# EAGLE design main (EAGLE 5.11)

## Sheet 1 of 7
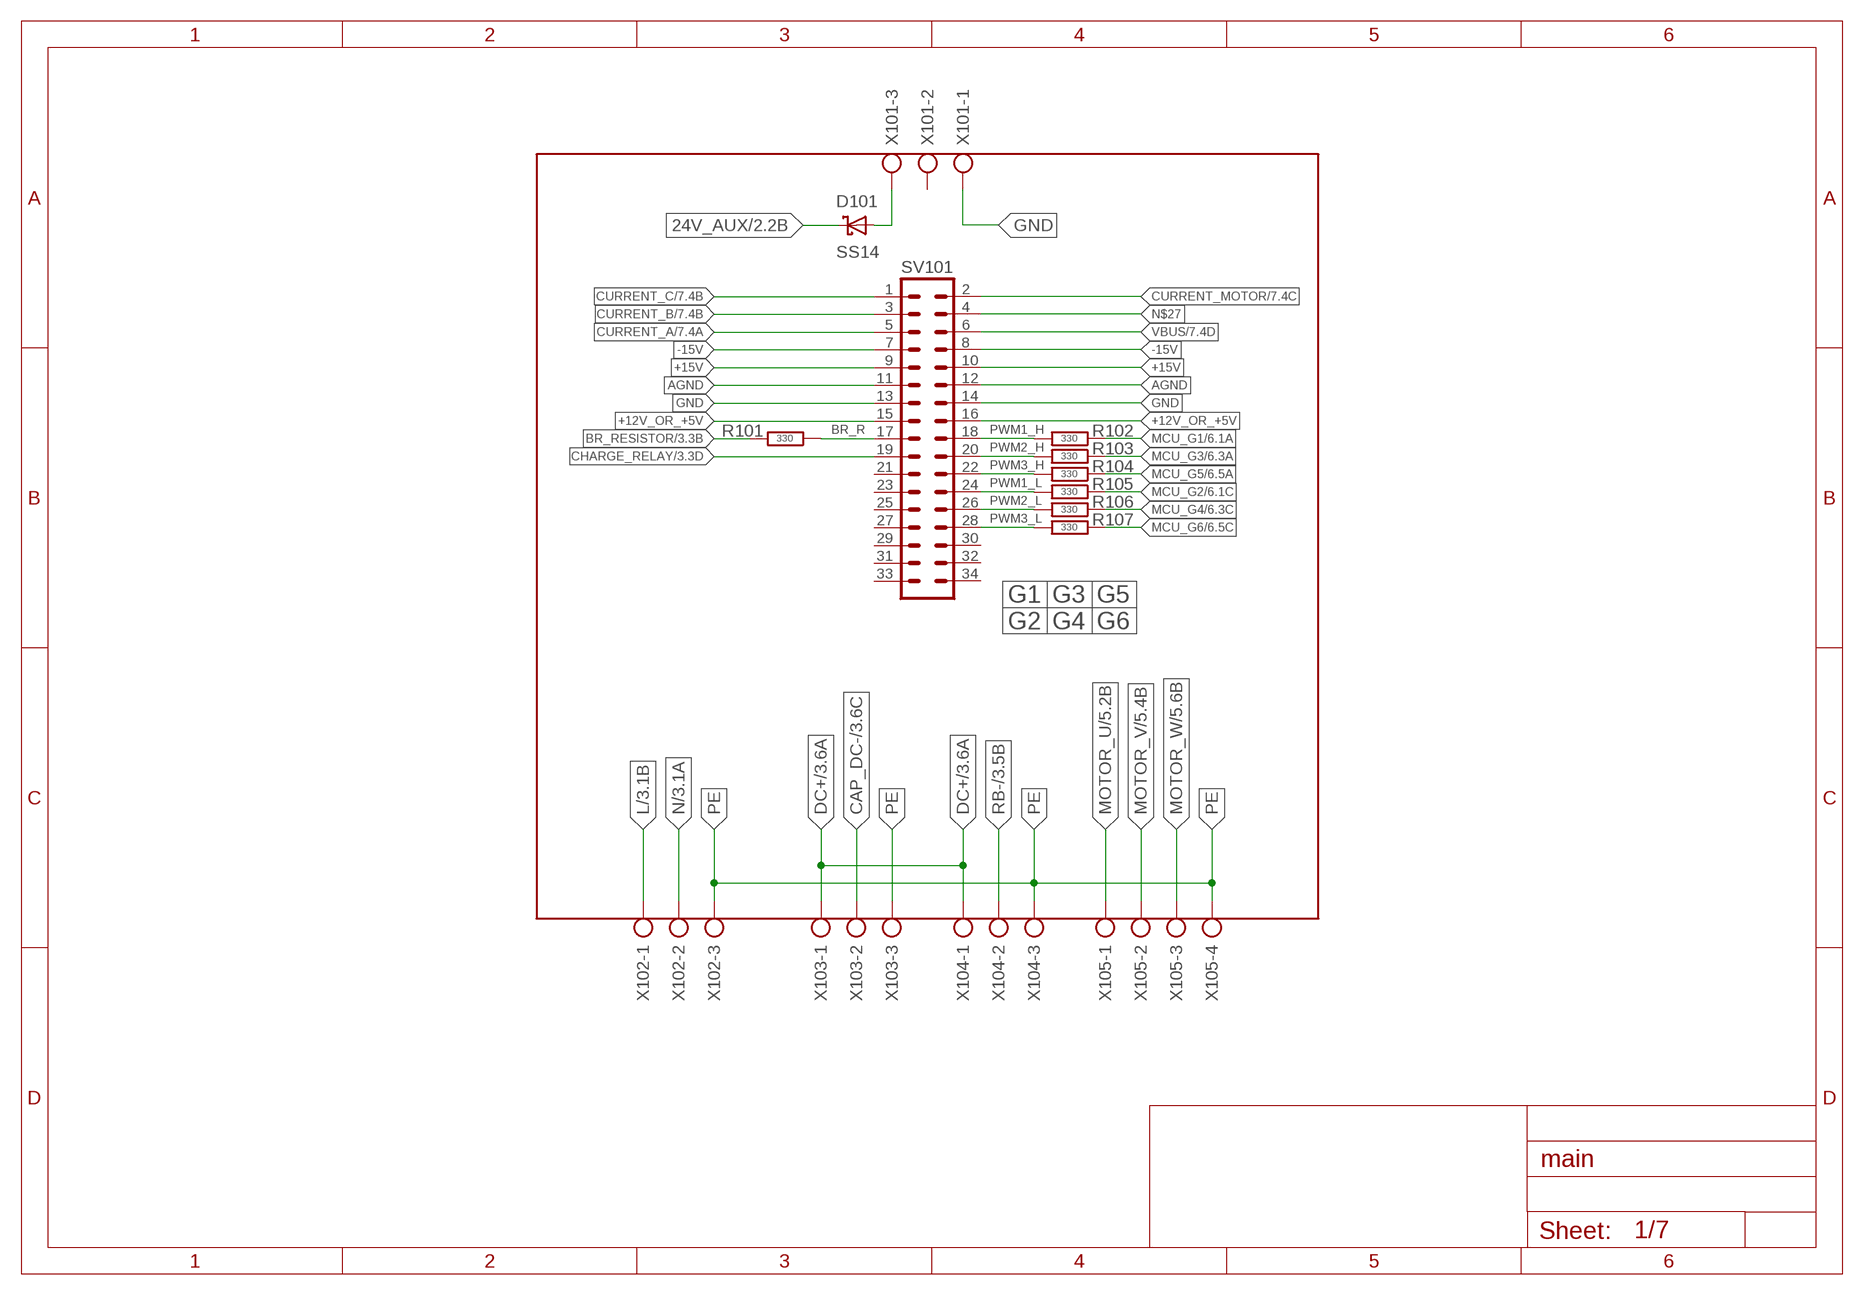
[diagram p0: schematic, sheet 1]

### Parts
D101  SS14  1N581SMD  [DO214AC]
R101  330  R-EU_R1206  [R1206]
R102  330  R-EU_R1206  [R1206]
R103  330  R-EU_R1206  [R1206]
R104  330  R-EU_R1206  [R1206]
R105  330  R-EU_R1206  [R1206]
R106  330  R-EU_R1206  [R1206]
R107  330  R-EU_R1206  [R1206]
SV101  ML34  [ML34]
X101  AK500/3-H  [AK500/3-H]
X102  AK500/3-H  [AK500/3-H]
X103  AK500/3-H  [AK500/3-H]
X104  AK500/3-H  [AK500/3-H]
X105  AK500/4-H  [AK500/4-H]

### Nets
24V_AUX: D101.C ; also sheet 2
+12V_OR_+5V: SV101.15 SV101.16 ; also sheet 2,3,4
+15V: SV101.9 SV101.10 ; also sheet 2,7
-15V: SV101.7 SV101.8 ; also sheet 2,7
AGND: SV101.11 SV101.12 ; also sheet 2,7
BR_R: R101.1 SV101.17
BR_RESISTOR: R101.2 ; also sheet 3
CAP_DC-: X103.2 ; also sheet 3,7
CHARGE_RELAY: SV101.19 ; also sheet 3
CURRENT_A: SV101.5 ; also sheet 7
CURRENT_B: SV101.3 ; also sheet 7
CURRENT_C: SV101.1 ; also sheet 7
CURRENT_MOTOR: SV101.2 ; also sheet 7
DC+: X103.1 X104.1 ; also sheet 3,5
GND: SV101.13 SV101.14 X101.1 ; also sheet 2,3,4,6
L: X102.1 ; also sheet 3
MCU_G1: R102.1 ; also sheet 6
MCU_G2: R105.1 ; also sheet 6
MCU_G3: R103.1 ; also sheet 6
MCU_G4: R106.1 ; also sheet 6
MCU_G5: R104.1 ; also sheet 6
MCU_G6: R107.1 ; also sheet 6
MOTOR_U: X105.1 ; also sheet 5,7
MOTOR_V: X105.2 ; also sheet 5,7
MOTOR_W: X105.3 ; also sheet 5,7
N: X102.2 ; also sheet 3
N$27: SV101.4
N$42: D101.A X101.3
PE: X102.3 X103.3 X104.3 X105.4
PWM1_H: R102.2 SV101.18
PWM1_L: R105.2 SV101.24
PWM2_H: R103.2 SV101.20
PWM2_L: R106.2 SV101.26
PWM3_H: R104.2 SV101.22
PWM3_L: R107.2 SV101.28
RB-: X104.2 ; also sheet 3
VBUS: SV101.6 ; also sheet 7
Unconnected: SV101.21 SV101.23 SV101.25 SV101.27 SV101.29 SV101.30 SV101.31 SV101.32 SV101.33 SV101.34 X101.2

### Notes on the sheet
- G1 | G3 | G5
- G2 | G4 | G6

## Sheet 2 of 7
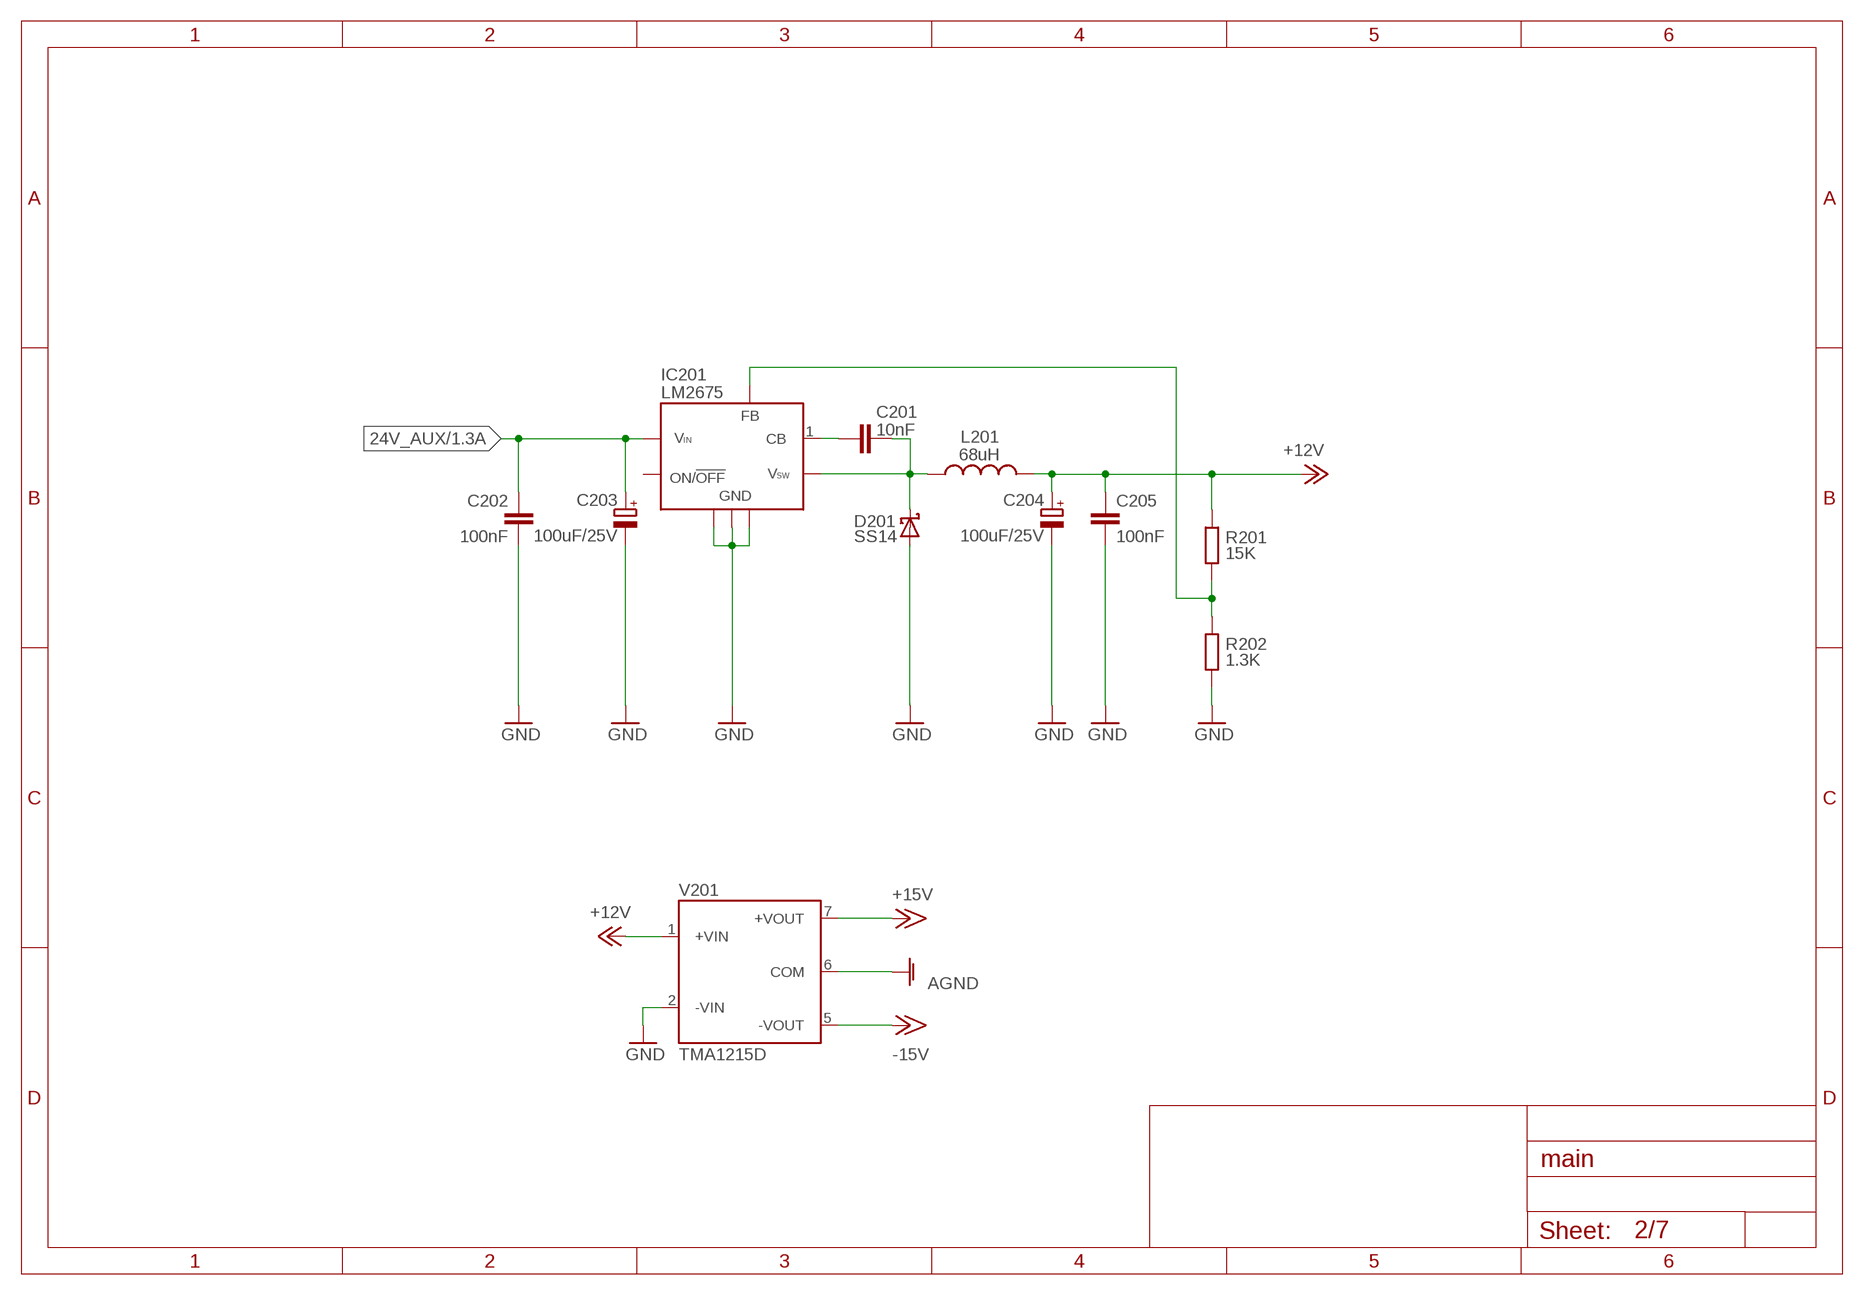
[diagram p1: schematic, sheet 2]

### Parts
C201  10nF  C-EUC0603  [C0603]
C202  100nF  C-EUC0603  [C0603]
C203  100uF/25V  CPOL-EUE2.5-5  [E2,5-5]
C204  100uF/25V  CPOL-EUE2,5-6E  [E2,5-6E]
C205  100nF  C-EUC0603  [C0603]
D201  SS14  1N581SMD  [DO214AC]
IC201  LM2675  [SO08]
L201  68uH  L-USSW45-V  [CW45-V]
R201  15K  R-EU_0204/2V  [0204V]
R202  1.3K  R-EU_R0603  [R0603]
V201  TMA1215D  TMA0515D  [TMA_DUAL]

### Nets
24V_AUX: C202.1 C203.+ IC201.7(VIN) ; also sheet 1
+12V_OR_+5V: C204.+ C205.1 L201.P$2 R201.2 V201.1(+VIN) ; supply symbol labelled +12V ; also sheet 1,3,4
+15V: V201.7(+VOUT) ; also sheet 1,7
-15V: V201.5(-VOUT) ; also sheet 1,7
AGND: V201.6(COM) ; also sheet 1,7
GND: C202.2 C203.- C204.- C205.2 D201.A IC201.2 IC201.3 IC201.6(GND) R202.1 V201.2(-VIN) ; also sheet 1,3,4,6
N$28: IC201.4(FB) R201.1 R202.2
N$72: C201.2 D201.C IC201.8(VSW) L201.P$1
N$80: C201.1 IC201.1(CB)
Unconnected: IC201.5(ON/!OFF)

## Sheet 3 of 7
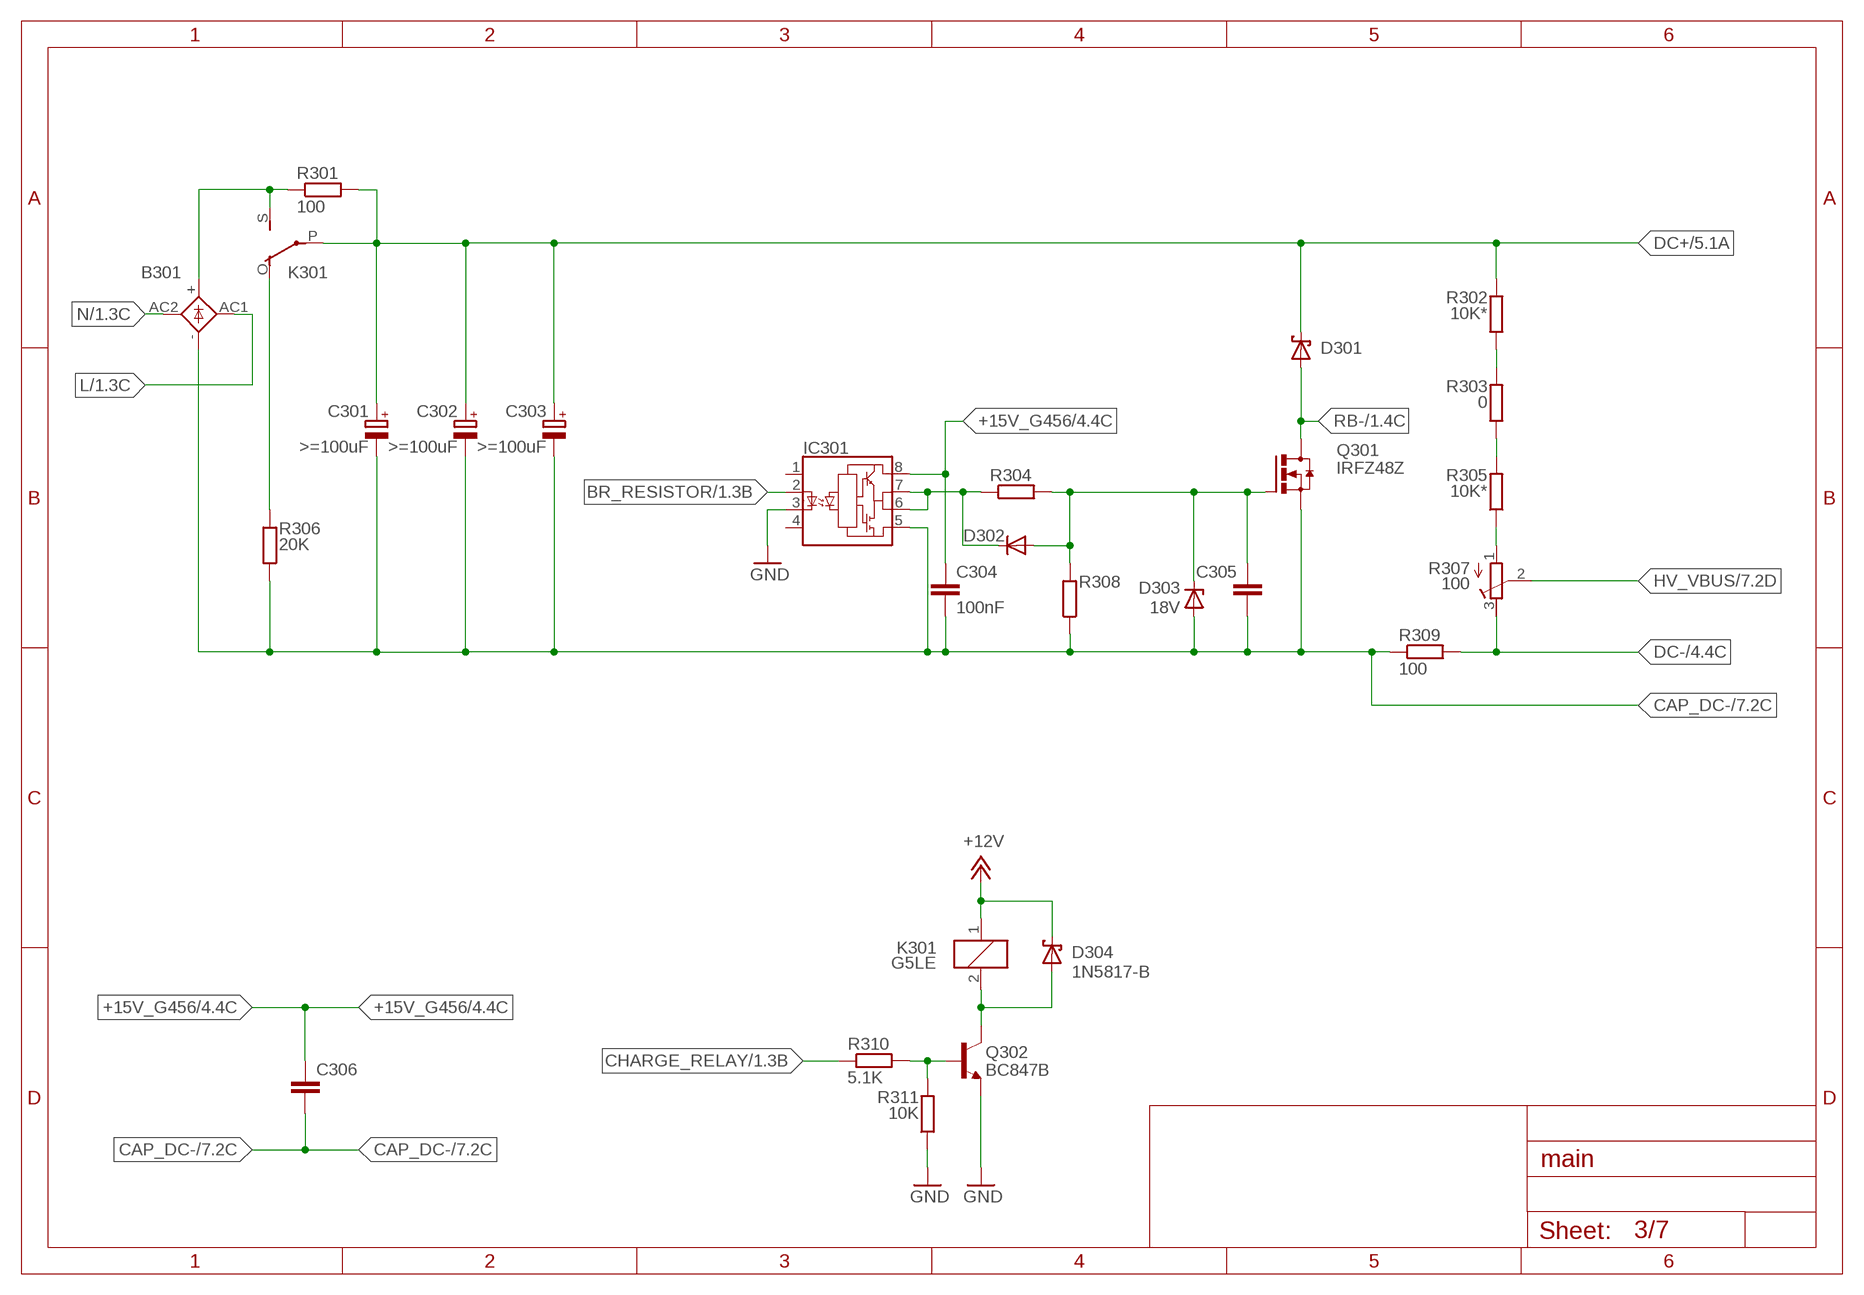
[diagram p2: schematic, sheet 3]

### Parts
B301  KBU  [KBU]
C301  >=100uF  CPOL-EUE10-22.5  [EB22,5D]
C302  >=100uF  CPOL-EUE10-22.5  [EB22,5D]
C303  >=100uF  CPOL-EUE10-22.5  [EB22,5D]
C304  100nF  C-EUC0603  [C0603]
C305  C-EUC0805  [C0805]
C306  C-EUC1206  [C1206]
D301  1N581SMD  [DO214AC]
D302  DIODE-DO214AA  [DO214AA]
D303  18V  ZENER-DIODESOD80C  [SOD80C]
D304  1N5817-B  1N581SMD  [DO214AC]
IC301  ELDI  [DIL8-SMD]
K301  G5LE  [G5LE]
Q301  IRFZ48Z  IRFZ48  [TO220BH-HV1]
Q302  BC847B  BC849SMD  [SOT23-BEC]
R301  100  R-EU_VTA52  [VTA52]
R302  10K*  R-EU_0204/2V  [0204V]
R303  0  R-EU_0204/2V  [0204V]
R304  R-EU_R1206  [R1206]
R305  10K*  R-EU_0204/2V  [0204V]
R306  20K  R-EU_RDH/15  [RDH/15]
R307  100  R-TRIMM3296W  [RTRIM3296W]
R308  R-EU_M0805  [M0805]
R309  100  R-EU_R2512  [R2512]
R310  5.1K  R-EU_R0805  [R0805]
R311  10K  R-EU_R0805  [R0805]

### Nets
+12V_OR_+5V: D304.C K301.1 ; supply symbol labelled +12V ; also sheet 1,2,4
+15V_G456: C304.1 C306.1 IC301.8 ; also sheet 4,6,7
BR_RESISTOR: IC301.2 ; also sheet 1
CAP_DC-: B301.- C301.- C302.- C303.- C304.2 C305.2 C306.2 D303.A IC301.5 Q301.S R306.1 R308.1 R309.1 ; also sheet 1,7
CHARGE_RELAY: R310.1 ; also sheet 1
DC+: C301.+ C302.+ C303.+ D301.C K301.P(2:P) R301.2 R302.2 ; also sheet 1,5
DC-: R307.3(A) R309.2 ; also sheet 4,5,6,7
GND: IC301.3 Q302.E R311.1 ; also sheet 1,2,4,6
HV_VBUS: R307.2(S) ; also sheet 7
L: B301.AC1 ; also sheet 1
N: B301.AC2 ; also sheet 1
N$5: D302.C IC301.6 IC301.7 R304.1
N$9: K301.O(2:O) R306.2
N$10: R303.1 R305.2
N$14: B301.+ K301.S(2:S) R301.1
N$15: C305.1 D302.A D303.C Q301.G R304.2 R308.2
N$16: R302.1 R303.2
N$24: R305.1 R307.1(E)
N$31: D304.A K301.2 Q302.C
N$32: Q302.B R310.2 R311.2
RB-: D301.A Q301.D ; also sheet 1
Unconnected: IC301.1 IC301.4

## Sheet 4 of 7
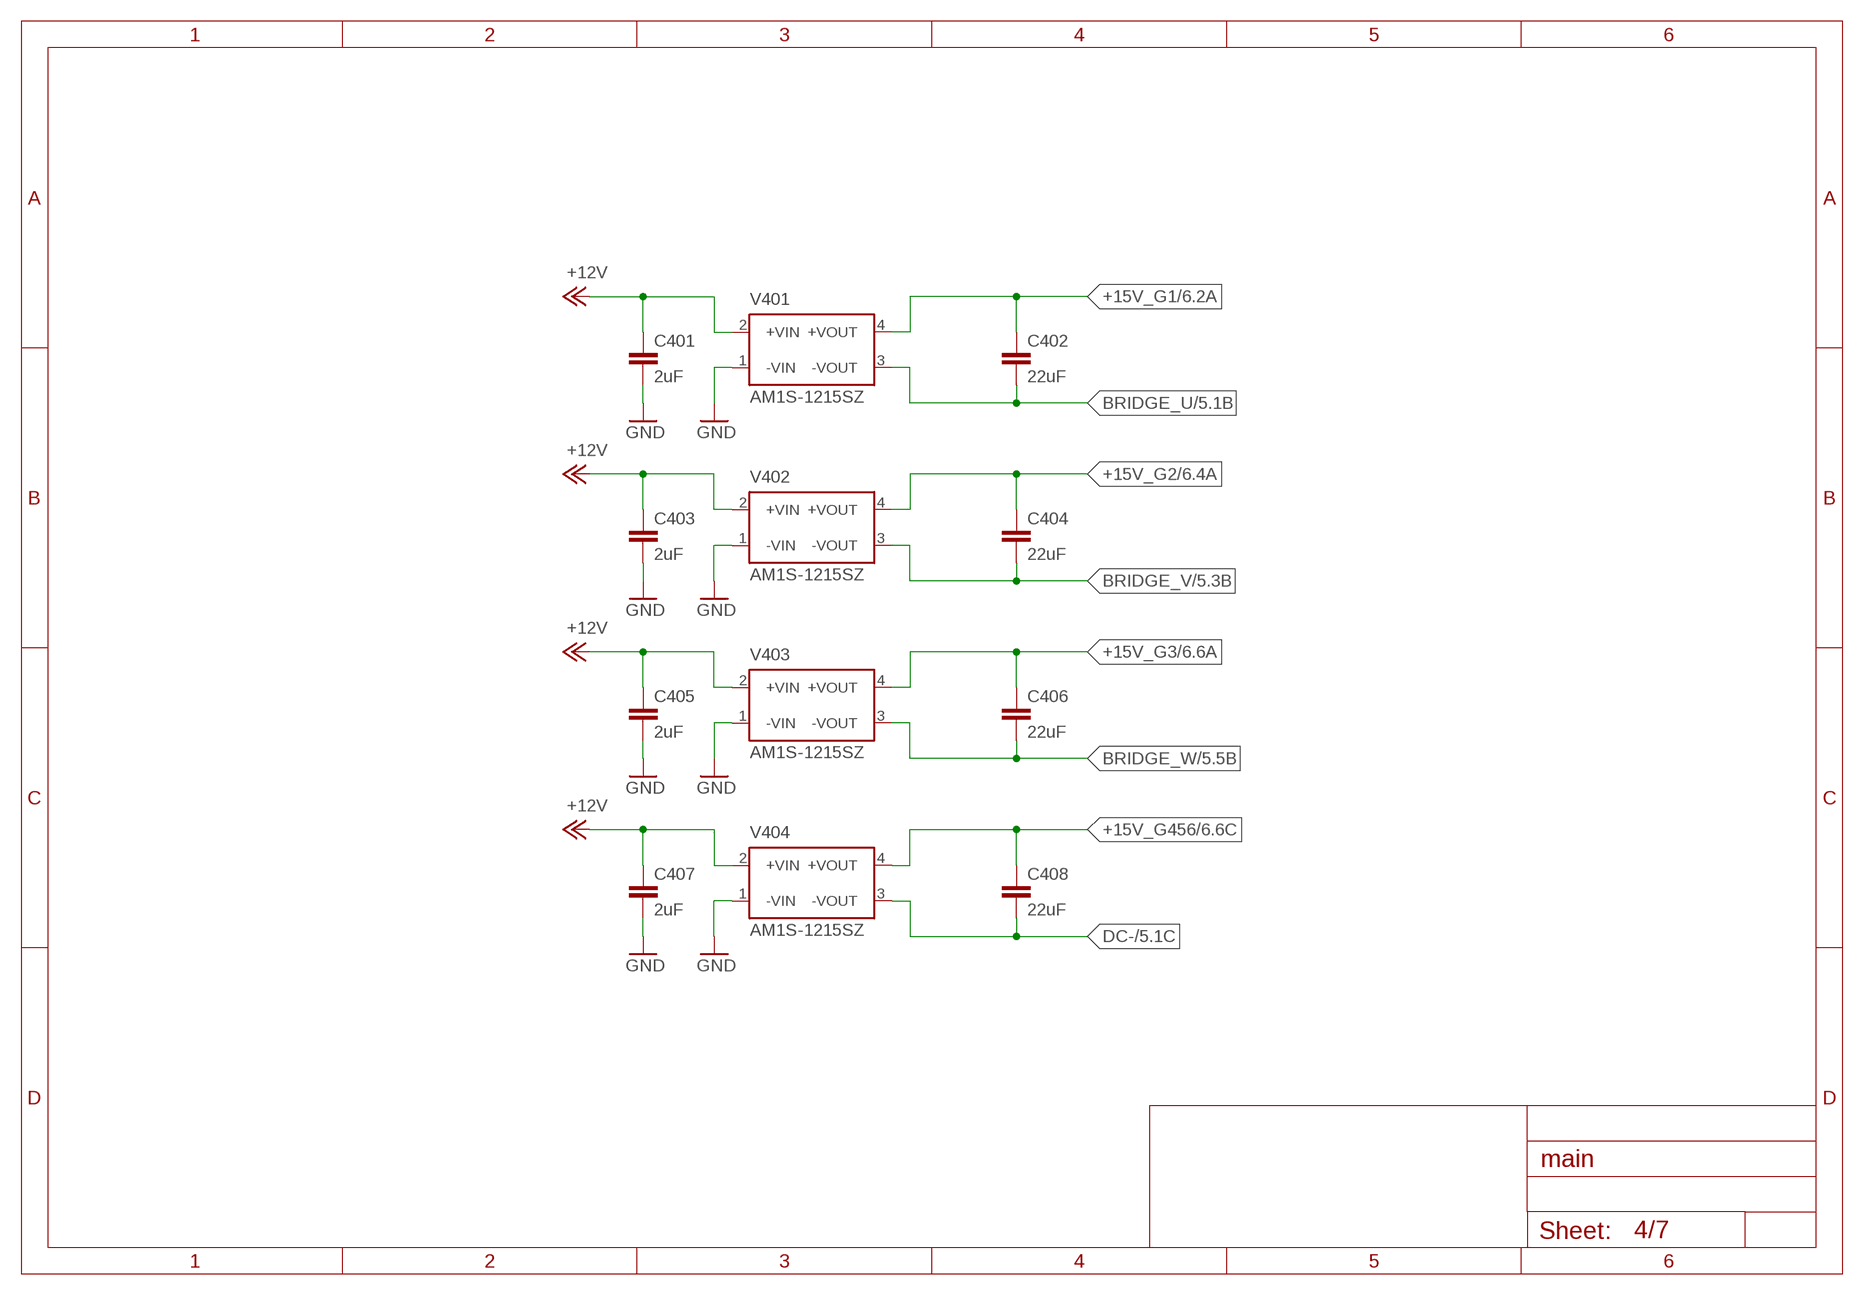
[diagram p3: schematic, sheet 4]

### Parts
C401  2uF  C-EUC1206  [C1206]
C402  22uF  C-EUC1206  [C1206]
C403  2uF  C-EUC1206  [C1206]
C404  22uF  C-EUC1206  [C1206]
C405  2uF  C-EUC1206  [C1206]
C406  22uF  C-EUC1206  [C1206]
C407  2uF  C-EUC1206  [C1206]
C408  22uF  C-EUC1206  [C1206]
V401  AM1S-1215SZ  TME0505S  [TME]
V402  AM1S-1215SZ  TME0505S  [TME]
V403  AM1S-1215SZ  TME0505S  [TME]
V404  AM1S-1215SZ  TME0505S  [TME]

### Nets
+12V_OR_+5V: C401.1 C403.1 C405.1 C407.1 V401.2(+VIN) V402.2(+VIN) V403.2(+VIN) V404.2(+VIN) ; supply symbol labelled +12V ; also sheet 1,2,3
+15V_G1: C402.1 V401.4(+VOUT) ; also sheet 6,7
+15V_G2: C404.1 V402.4(+VOUT) ; also sheet 6,7
+15V_G3: C406.1 V403.4(+VOUT) ; also sheet 6,7
+15V_G456: C408.1 V404.4(+VOUT) ; also sheet 3,6,7
BRIDGE_U: C402.2 V401.3(-VOUT) ; also sheet 5,6,7
BRIDGE_V: C404.2 V402.3(-VOUT) ; also sheet 5,6,7
BRIDGE_W: C406.2 V403.3(-VOUT) ; also sheet 5,6,7
DC-: C408.2 V404.3(-VOUT) ; also sheet 3,5,6,7
GND: C401.2 C403.2 C405.2 C407.2 V401.1(-VIN) V402.1(-VIN) V403.1(-VIN) V404.1(-VIN) ; also sheet 1,2,3,6

## Sheet 5 of 7
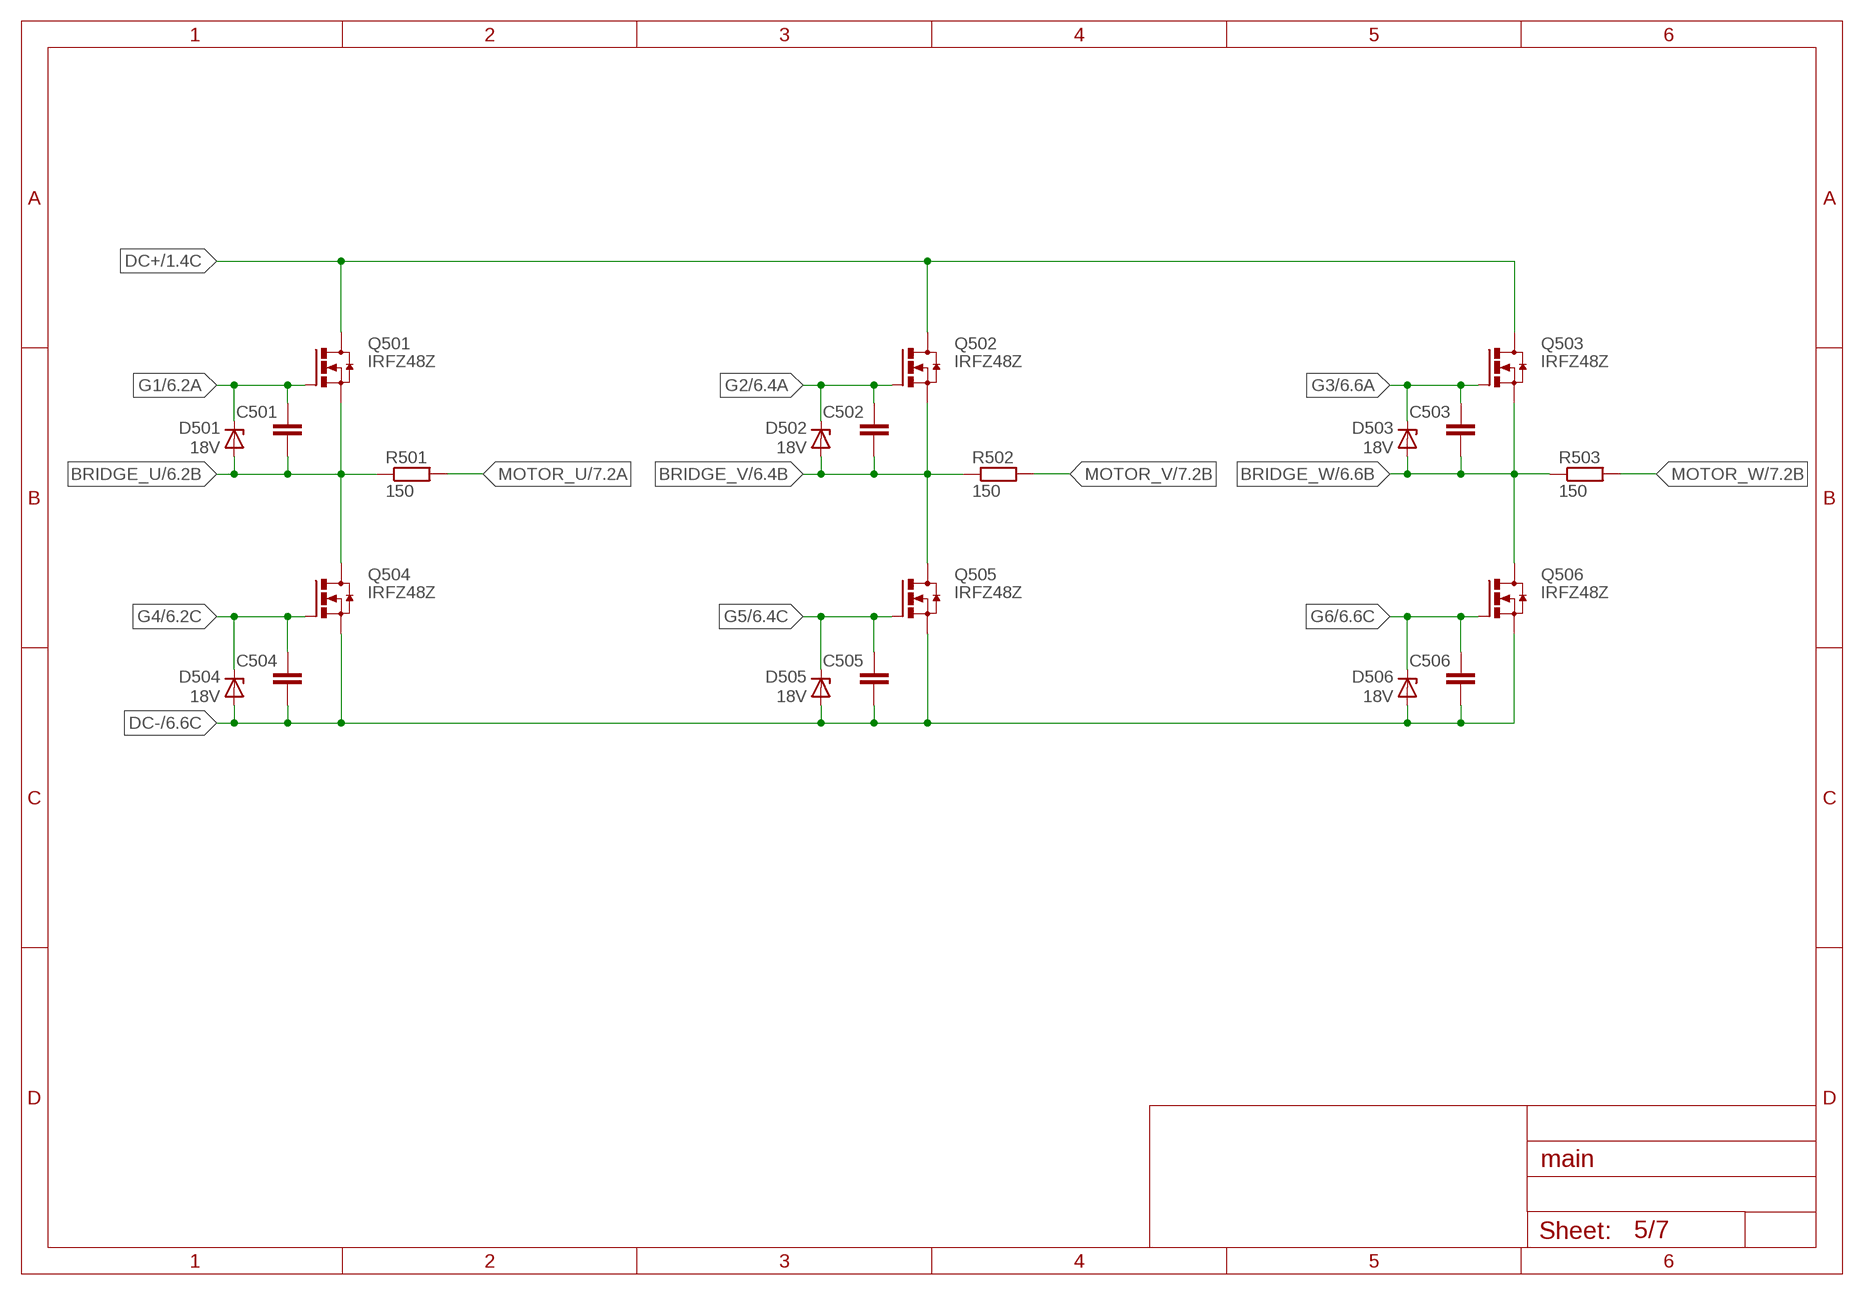
[diagram p4: schematic, sheet 5]

### Parts
C501  C-EUC0805  [C0805]
C502  C-EUC0805  [C0805]
C503  C-EUC0805  [C0805]
C504  C-EUC0805  [C0805]
C505  C-EUC0805  [C0805]
C506  C-EUC0805  [C0805]
D501  18V  ZENER-DIODESOD80C  [SOD80C]
D502  18V  ZENER-DIODESOD80C  [SOD80C]
D503  18V  ZENER-DIODESOD80C  [SOD80C]
D504  18V  ZENER-DIODESOD80C  [SOD80C]
D505  18V  ZENER-DIODESOD80C  [SOD80C]
D506  18V  ZENER-DIODESOD80C  [SOD80C]
Q501  IRFZ48Z  IRFZ48  [TO220BH-HV1]
Q502  IRFZ48Z  IRFZ48  [TO220BH-HV1]
Q503  IRFZ48Z  IRFZ48  [TO220BH-HV1]
Q504  IRFZ48Z  IRFZ48  [TO220BH-HV1]
Q505  IRFZ48Z  IRFZ48  [TO220BH-HV1]
Q506  IRFZ48Z  IRFZ48  [TO220BH-HV1]
R501  150  R-EU_R2512  [R2512]
R502  150  R-EU_R2512  [R2512]
R503  150  R-EU_R2512  [R2512]

### Nets
BRIDGE_U: C501.2 D501.A Q501.S Q504.D R501.1 ; also sheet 4,6,7
BRIDGE_V: C502.2 D502.A Q502.S Q505.D R502.1 ; also sheet 4,6,7
BRIDGE_W: C503.2 D503.A Q503.S Q506.D R503.1 ; also sheet 4,6,7
DC+: Q501.D Q502.D Q503.D ; also sheet 1,3
DC-: C504.2 C505.2 C506.2 D504.A D505.A D506.A Q504.S Q505.S Q506.S ; also sheet 3,4,6,7
G1: C501.1 D501.C Q501.G ; also sheet 6
G2: C502.1 D502.C Q502.G ; also sheet 6
G3: C503.1 D503.C Q503.G ; also sheet 6
G4: C504.1 D504.C Q504.G ; also sheet 6
G5: C505.1 D505.C Q505.G ; also sheet 6
G6: C506.1 D506.C Q506.G ; also sheet 6
MOTOR_U: R501.2 ; also sheet 1,7
MOTOR_V: R502.2 ; also sheet 1,7
MOTOR_W: R503.2 ; also sheet 1,7

## Sheet 6 of 7
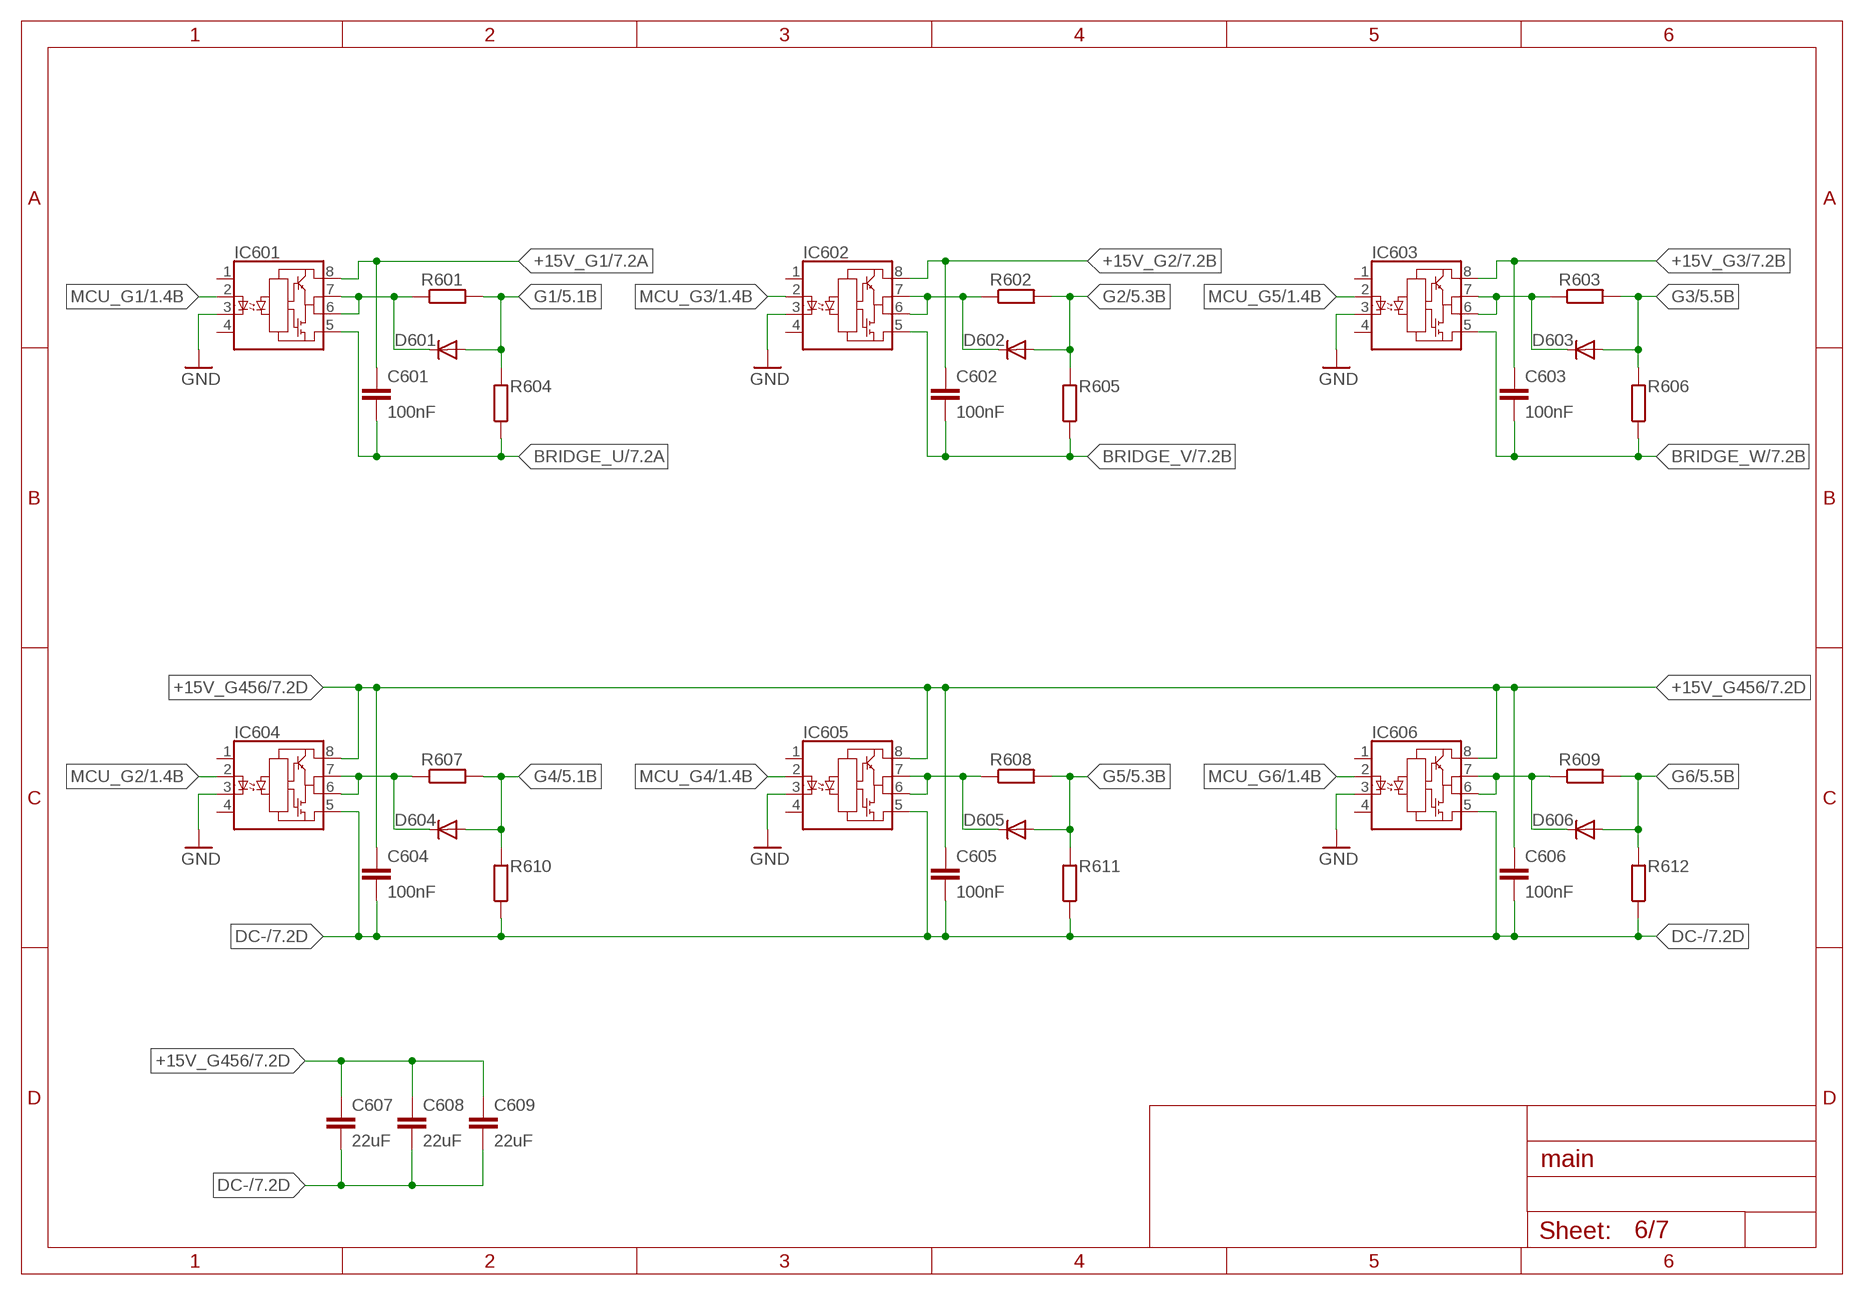
[diagram p5: schematic, sheet 6]

### Parts
C601  100nF  C-EUC0603  [C0603]
C602  100nF  C-EUC0603  [C0603]
C603  100nF  C-EUC0603  [C0603]
C604  100nF  C-EUC0603  [C0603]
C605  100nF  C-EUC0603  [C0603]
C606  100nF  C-EUC0603  [C0603]
C607  22uF  C-EUC1206  [C1206]
C608  22uF  C-EUC1206  [C1206]
C609  22uF  C-EUC1206  [C1206]
D601  DIODE-DO214AA  [DO214AA]
D602  DIODE-DO214AA  [DO214AA]
D603  DIODE-DO214AA  [DO214AA]
D604  DIODE-DO214AA  [DO214AA]
D605  DIODE-DO214AA  [DO214AA]
D606  DIODE-DO214AA  [DO214AA]
IC601  ELDI  [DIL8-SMD]
IC602  ELDI  [DIL8-SMD]
IC603  ELDI  [DIL8-SMD]
IC604  ELDI  [DIL8-SMD]
IC605  ELDI  [DIL8-SMD]
IC606  ELDI  [DIL8-SMD]
R601  R-EU_R1206  [R1206]
R602  R-EU_R1206  [R1206]
R603  R-EU_R1206  [R1206]
R604  R-EU_M0805  [M0805]
R605  R-EU_M0805  [M0805]
R606  R-EU_M0805  [M0805]
R607  R-EU_R1206  [R1206]
R608  R-EU_R1206  [R1206]
R609  R-EU_R1206  [R1206]
R610  R-EU_M0805  [M0805]
R611  R-EU_M0805  [M0805]
R612  R-EU_M0805  [M0805]

### Nets
+15V_G1: C601.1 IC601.8 ; also sheet 4,7
+15V_G2: C602.1 IC602.8 ; also sheet 4,7
+15V_G3: C603.1 IC603.8 ; also sheet 4,7
+15V_G456: C604.1 C605.1 C606.1 C607.1 C608.1 C609.1 IC604.8 IC605.8 IC606.8 ; also sheet 3,4,7
BRIDGE_U: C601.2 IC601.5 R604.1 ; also sheet 4,5,7
BRIDGE_V: C602.2 IC602.5 R605.1 ; also sheet 4,5,7
BRIDGE_W: C603.2 IC603.5 R606.1 ; also sheet 4,5,7
DC-: C604.2 C605.2 C606.2 C607.2 C608.2 C609.2 IC604.5 IC605.5 IC606.5 R610.1 R611.1 R612.1 ; also sheet 3,4,5,7
G1: D601.A R601.2 R604.2 ; also sheet 5
G2: D602.A R602.2 R605.2 ; also sheet 5
G3: D603.A R603.2 R606.2 ; also sheet 5
G4: D604.A R607.2 R610.2 ; also sheet 5
G5: D605.A R608.2 R611.2 ; also sheet 5
G6: D606.A R609.2 R612.2 ; also sheet 5
GND: IC601.3 IC602.3 IC603.3 IC604.3 IC605.3 IC606.3 ; also sheet 1,2,3,4
MCU_G1: IC601.2 ; also sheet 1
MCU_G2: IC604.2 ; also sheet 1
MCU_G3: IC602.2 ; also sheet 1
MCU_G4: IC605.2 ; also sheet 1
MCU_G5: IC603.2 ; also sheet 1
MCU_G6: IC606.2 ; also sheet 1
N$6: D602.C IC602.6 IC602.7 R602.1
N$7: D601.C IC601.6 IC601.7 R601.1
N$8: D605.C IC605.6 IC605.7 R608.1
N$11: D603.C IC603.6 IC603.7 R603.1
N$12: D604.C IC604.6 IC604.7 R607.1
N$13: D606.C IC606.6 IC606.7 R609.1
Unconnected: IC601.1 IC601.4 IC602.1 IC602.4 IC603.1 IC603.4 IC604.1 IC604.4 IC605.1 IC605.4 IC606.1 IC606.4

## Sheet 7 of 7
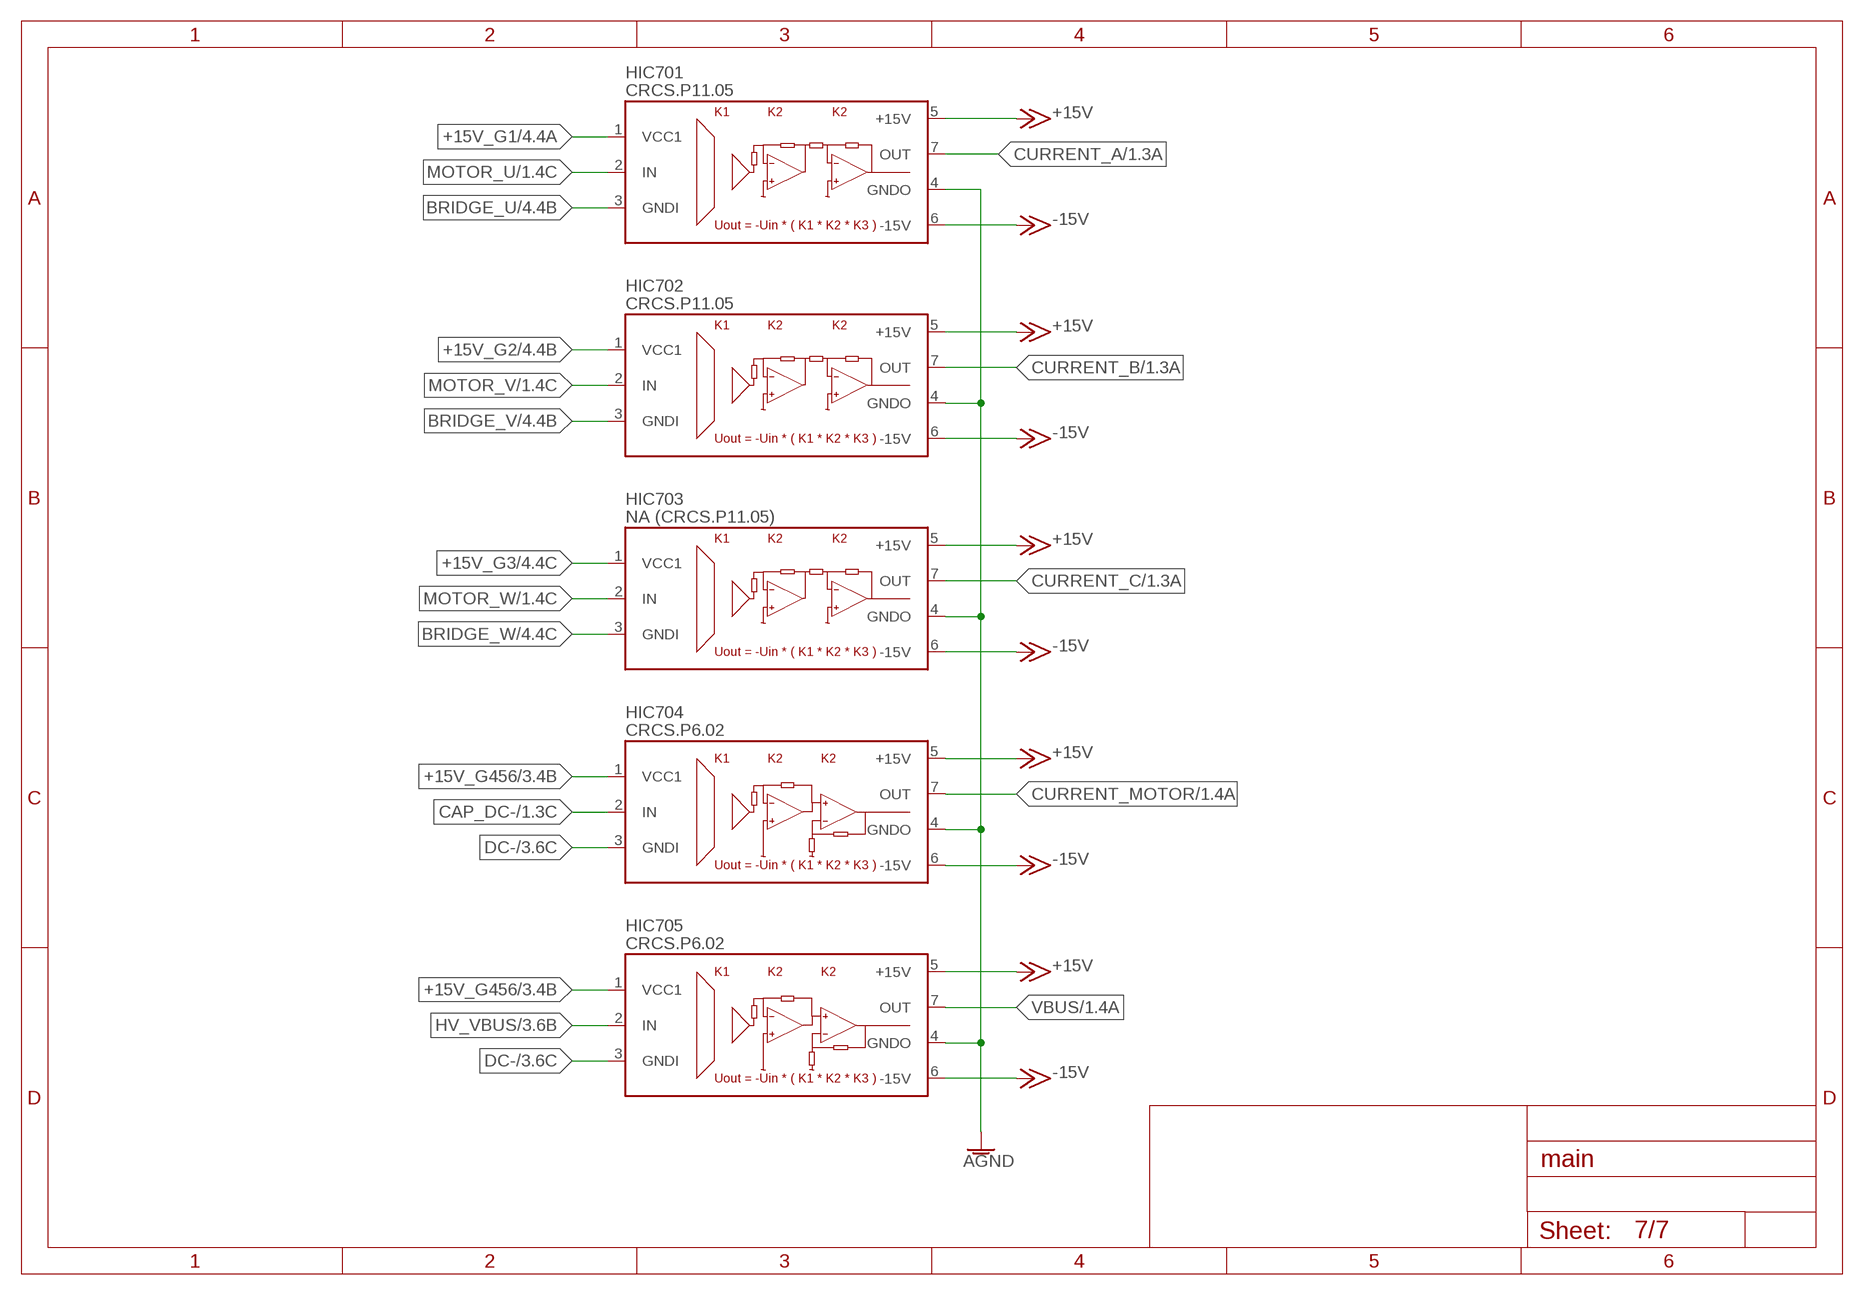
[diagram p6: schematic, sheet 7]

### Parts
HIC701  CRCS.P11.05  [CRCS.P11.05]
HIC702  CRCS.P11.05  [CRCS.P11.05]
HIC703  NA (CRCS.P11.05)  CRCS.P11.05  [CRCS.P11.05]
HIC704  CRCS.P6.02  [CRCS.P6.02]
HIC705  CRCS.P6.02  [CRCS.P6.02]

### Nets
+15V: HIC701.5(+15V) HIC702.5(+15V) HIC703.5(+15V) HIC704.5(+15V) HIC705.5(+15V) ; also sheet 1,2
+15V_G1: HIC701.1(VCC1) ; also sheet 4,6
+15V_G2: HIC702.1(VCC1) ; also sheet 4,6
+15V_G3: HIC703.1(VCC1) ; also sheet 4,6
+15V_G456: HIC704.1(VCC1) HIC705.1(VCC1) ; also sheet 3,4,6
-15V: HIC701.6(-15V) HIC702.6(-15V) HIC703.6(-15V) HIC704.6(-15V) HIC705.6(-15V) ; also sheet 1,2
AGND: HIC701.4(GNDO) HIC702.4(GNDO) HIC703.4(GNDO) HIC704.4(GNDO) HIC705.4(GNDO) ; also sheet 1,2
BRIDGE_U: HIC701.3(GNDI) ; also sheet 4,5,6
BRIDGE_V: HIC702.3(GNDI) ; also sheet 4,5,6
BRIDGE_W: HIC703.3(GNDI) ; also sheet 4,5,6
CAP_DC-: HIC704.2(IN) ; also sheet 1,3
CURRENT_A: HIC701.7(OUT) ; also sheet 1
CURRENT_B: HIC702.7(OUT) ; also sheet 1
CURRENT_C: HIC703.7(OUT) ; also sheet 1
CURRENT_MOTOR: HIC704.7(OUT) ; also sheet 1
DC-: HIC704.3(GNDI) HIC705.3(GNDI) ; also sheet 3,4,5,6
HV_VBUS: HIC705.2(IN) ; also sheet 3
MOTOR_U: HIC701.2(IN) ; also sheet 1,5
MOTOR_V: HIC702.2(IN) ; also sheet 1,5
MOTOR_W: HIC703.2(IN) ; also sheet 1,5
VBUS: HIC705.7(OUT) ; also sheet 1

## Library data of the parts
B301 = rectifier:KBU: DIOTEC RECTIFIER
C201 C202 C205 C304-C306 C401-C408 C501-C506 C601-C609 = rcl:C-EU: CAPACITOR, European symbol
C203 C204 C301-C303 = rcl:CPOL-EU: POLARIZED CAPACITOR, European symbol
D101 D201 D301 D304 = diode:1N581*: 1.0A SCHOTTKY BARRIER RECTIFIER Source: http://www.diodes.com/datasheets/ds23001.pdf
D302 D601-D606 = diode:DIODE-: DIODE
D303 D501-D506 = diode:ZENER-DIODE: Z-Diode
HIC701-HIC703 = electroinvent:CRCS.P11.05
HIC704 HIC705 = electroinvent:CRCS.P6.02
IC201 = linear:LM2675
IC301 IC601-IC606 = myOptocoupler:ELDI
K301 = relay:G5LE: RELAY 1 x switch, 10 A/120 V AC, 8 A/30 V DC, Omron; OC_FARNELL: unknown; OC_NEWARK: unknown
L201 = rcl:L-US: INDUCTOR, American symbol
Q301 Q501-Q506 = myTransistor-Power:IRFZ48
Q302 = transistor-npn:BC849*: NPN Transistor
R101-R107 R201 R202 R301-R306 R308-R311 R501-R503 R601-R612 = rcl:R-EU_: RESISTOR, European symbol
R307 = rcl:R-TRIMM: Trimm resistor
SV101 = con-harting-ml:ML34: HARTING; OC_FARNELL: unknown; OC_NEWARK: unknown
V201 = myTraco-electronic:TMA*?
V401-V404 = traco-electronic:TME?*: DC/DC Converter TME Series 1 Watt Source: www.tracopower.com .. tme.pdf; MPN: TME 0505S; OC_FARNELL: 1007538; OC_NEWARK: 51R5321
X101-X104 = con-ptr500:AK500/3-H: CONNECTOR Aug. 2004 / PTR Meßtechnik: Die Bezeichnung der Serie AK505 wurde geändert. Es handelt sich hierbei um AK500 in horizontaler Ausführung.; OC_FARNELL: unknown; OC_NEWARK: unknown
X105 = con-ptr500:AK500/4-H: CONNECTOR Aug. 2004 / PTR Meßtechnik: Die Bezeichnung der Serie AK505 wurde geändert. Es handelt sich hierbei um AK500 in horizontaler Ausführung.; OC_FARNELL: unknown; OC_NEWARK: unknown

## Board
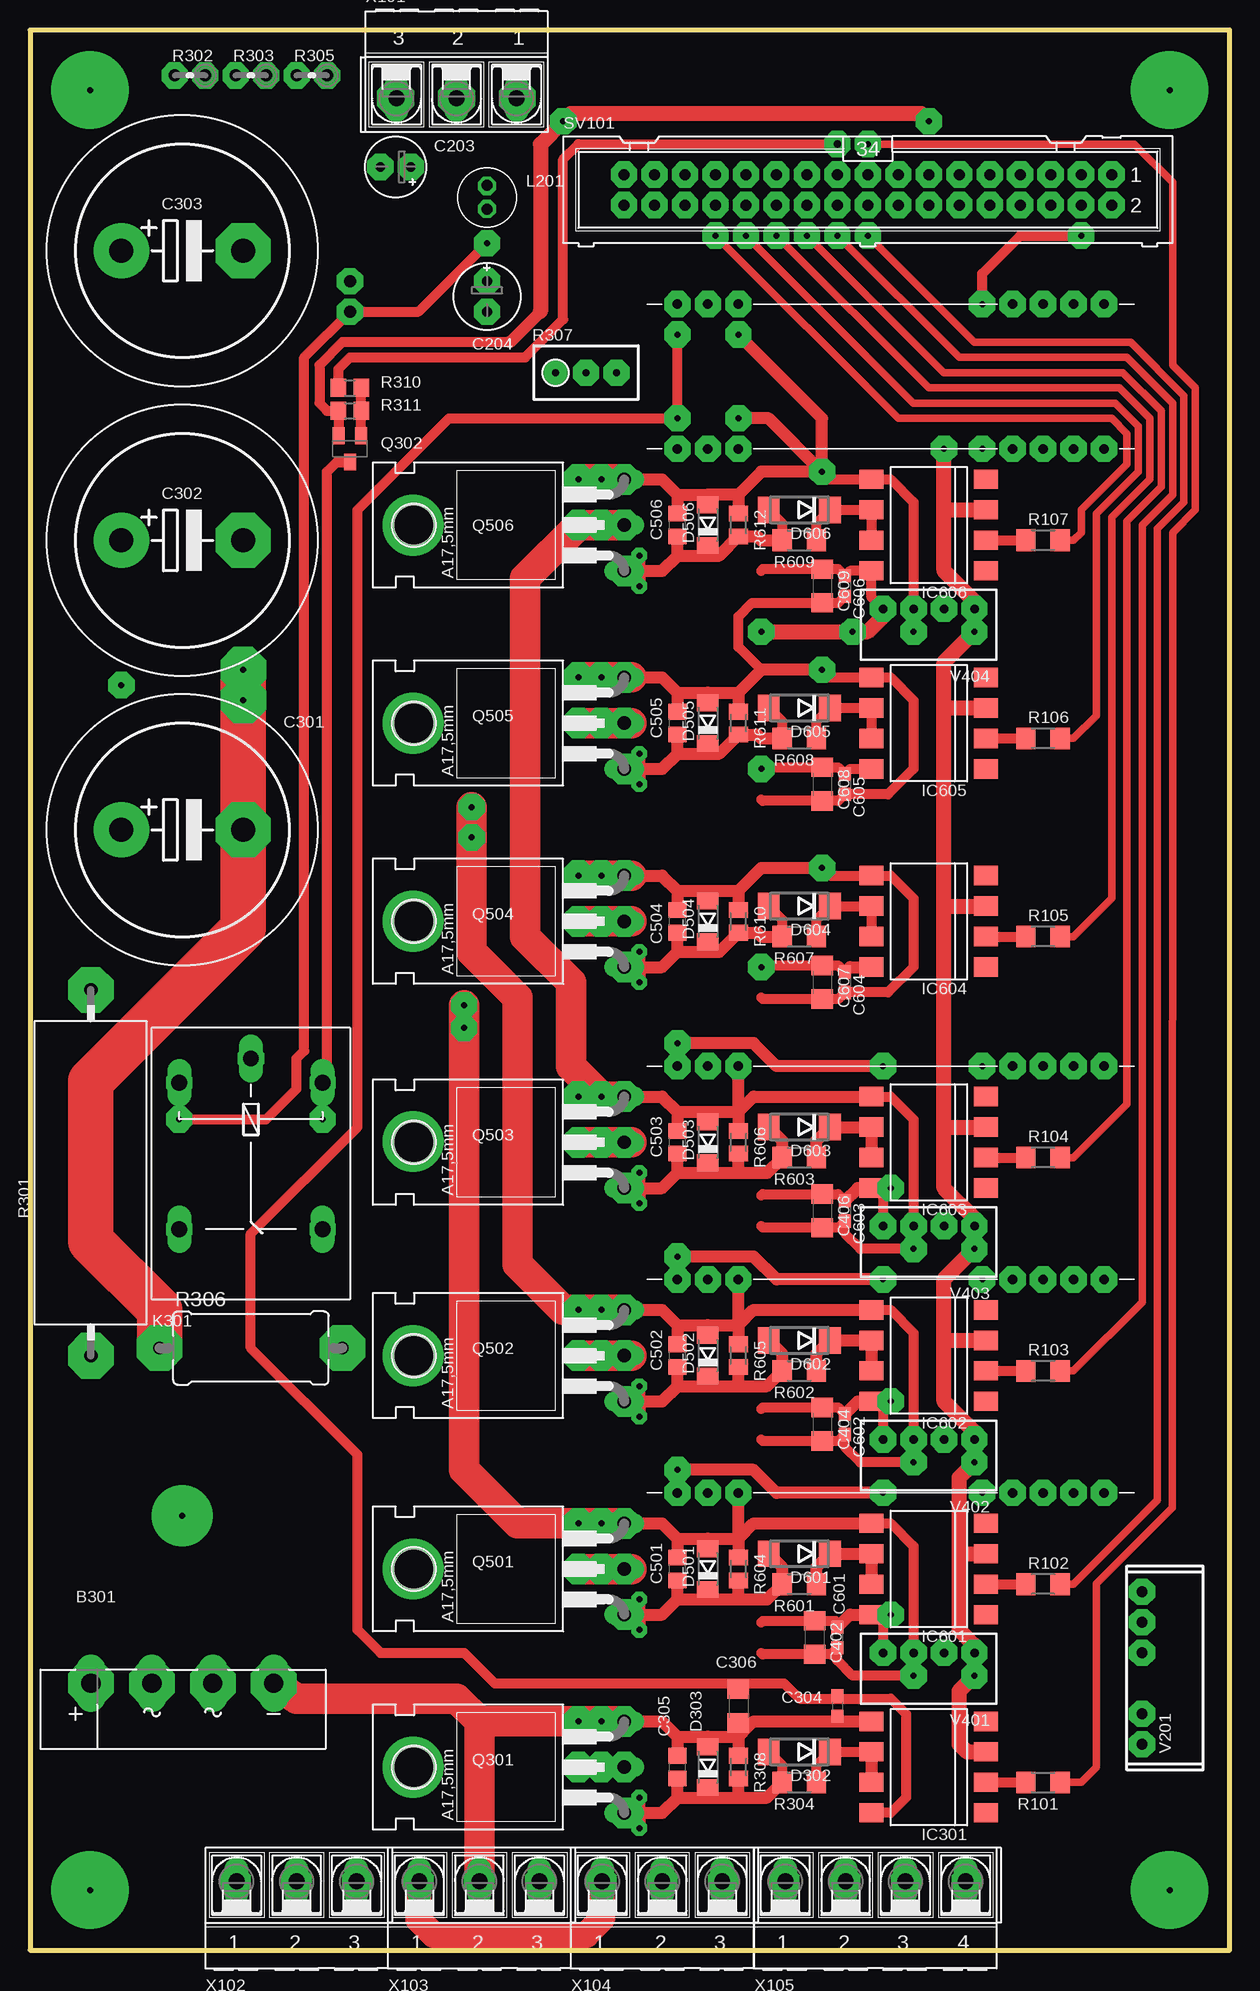
[diagram p7: board, top side]
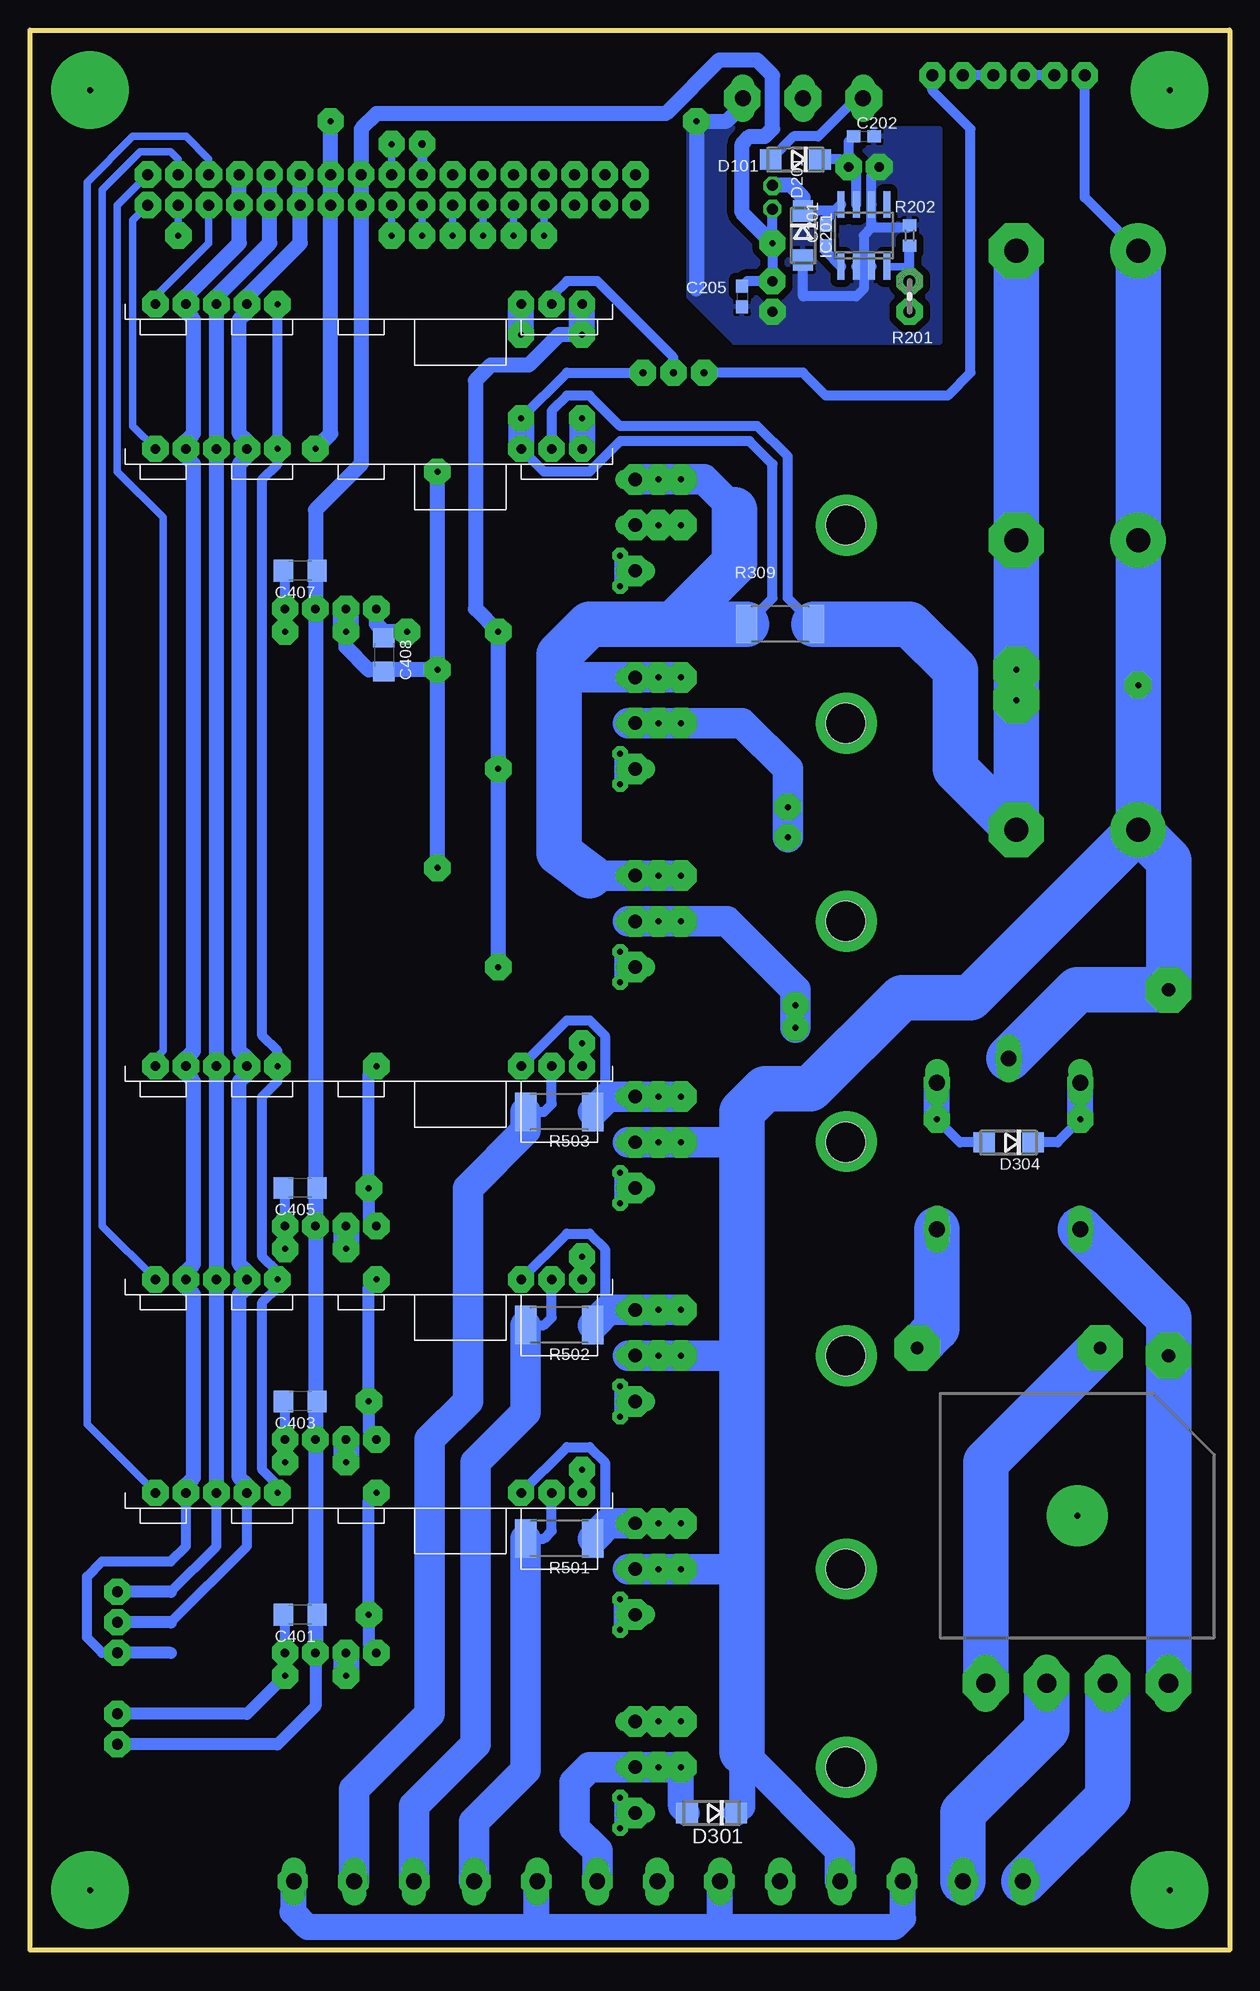
[diagram p8: board, bottom side, seen from below]

Size 100 x 160 mm. Coordinates in mm from the lower left corner, seen from the top.
Outline: 0,0 100,0 100,160 0,160 0,0
Copper layers (1*16): Top 0.035mm / dielectric 1.5mm / Bottom 0.035mm
Design rules "default": minimum track width 10mil, minimum drill 24mil, track to track 8mil, track to pad 8mil, pad to pad 8mil, via to via 8mil, smd to smd 8mil, copper to edge 40mil, drill to drill 8mil, minimum pad ring 10mil, minimum via ring 8mil, stop-mask expansion 4mil, vias tented up to drill 0mil, thermal gap 10mil

### Footprints (pad centres in the part's own frame; a part is rotated, then mirrored left to right if it is on the bottom)
KBU = drill 1.6 long: + -7.62,2.54; - 7.62,2.54; AC1 -2.54,2.54; AC2 2.54,2.54
C0603 = smd 1.1 x 1: 1 -0.85,0; 2 0.85,0
E2,5-5 = drill 0.813 pad 1.6 round: + -1.27,0 | drill 0.813 pad 1.6 octagon: - 1.27,0
E2,5-6E = drill 0.813 pad 1.575 round: + -1.27,0 | drill 0.813 pad 1.575 octagon: - 1.27,0
EB22,5D = drill 2.007 pad 4.597 round: + -5.08,0 | drill 2.007 pad 4.597 octagon: - 5.08,0
C0805 = smd 1.3 x 1.5: 1 -0.95,0; 2 0.95,0
C1206 = smd 1.6 x 1.8: 1 -1.4,0; 2 1.4,0
DO214AC = smd 1.8 x 1.7: A 2.05,0; C -2.05,0
DO214AA = smd 1.8 x 2.2: A 2.55,0; C -2.55,0
SOD80C = smd 1.4 x 1.8: A 1.7,0; C -1.7,0
CRCS.P11.05 = drill 0.8 square: 1 -12.7,0 | drill 0.8 octagon: 2 -10.16,0; 3 -7.62,0; 4 15.24,0; 5 17.78,0; 6 20.32,0; 7 22.86,0
CRCS.P6.02 = drill 0.8 square: 1 -12.7,0 | drill 0.8 octagon: 2 -10.16,0; 3 -7.62,0; 4 15.24,0; 5 17.78,0; 6 20.32,0; 7 22.86,0
SO08 = smd 0.6 x 2.2: 1 -1.905,-2.6; 2 -0.635,-2.6; 3 0.635,-2.6; 4 1.905,-2.6; 5 1.905,2.6; 6 0.635,2.6; 7 -0.635,2.6; 8 -1.905,2.6
DIL8-SMD = smd 1.6 x 2: 1 -3.81,-4.77; 2 -1.27,-4.77; 3 1.27,-4.77; 4 3.81,-4.77; 5 3.81,4.77; 6 1.27,4.77; 7 -1.27,4.77; 8 -3.81,4.77
G5LE = drill 1.321 long: 1 -7.493,-5.969; 2 -7.493,5.969; O 4.699,5.969; P -9.525,0; S 4.699,-5.969
CW45-V = drill 0.9 pad 1.422 octagon: P$1 -1,0; P$2 1,0
TO220BH-HV1 = drill 1.118 long: D 0,-6.35; G -3.81,-6.35; S 3.81,-6.35 | hole 3.302: 0,11.176
SOT23-BEC = smd 1 x 1.4: B -0.95,-1.1; C 0,1.1; E 0.95,-1.1
R1206 = smd 1.6 x 1.803: 1 -1.422,0; 2 1.422,0
0204V = drill 1 octagon: 1 -1.27,0; 2 1.27,0
R0603 = smd 1 x 1.1: 1 -0.85,0; 2 0.85,0
VTA52 = drill 1.1 octagon: 1 -15.24,0; 2 15.24,0
RDH/15 = drill 1.016 octagon: 1 -7.62,0; 2 7.62,0
RTRIM3296W = drill 0.61 round: 1 0,-2.54; 2 0,0; 3 0,2.54
M0805 = smd 1.3 x 1.6: 1 -0.95,0; 2 0.95,0
R2512 = smd 1.8 x 3.2: 1 -2.8,0; 2 2.8,0
R0805 = smd 1.3 x 1.5: 1 -0.95,0; 2 0.95,0
ML34 = drill 0.914 octagon: 1 -20.32,-1.27; 2 -20.32,1.27; 3 -17.78,-1.27; 4 -17.78,1.27; 5 -15.24,-1.27; 6 -15.24,1.27; 7 -12.7,-1.27; 8 -12.7,1.27; 9 -10.16,-1.27; 10 -10.16,1.27; 11 -7.62,-1.27; 12 -7.62,1.27; 13 -5.08,-1.27; 14 -5.08,1.27; 15 -2.54,-1.27; 16 -2.54,1.27; 17 0,-1.27; 18 0,1.27; 19 2.54,-1.27; 20 2.54,1.27; 21 5.08,-1.27; 22 5.08,1.27; 23 7.62,-1.27; 24 7.62,1.27; 25 10.16,-1.27; 26 10.16,1.27; 27 12.7,-1.27; 28 12.7,1.27; 29 15.24,-1.27; 30 15.24,1.27; 31 17.78,-1.27; 32 17.78,1.27; 33 20.32,-1.27; 34 20.32,1.27
TMA_DUAL = drill 0.9 round: 1 -5.08,0; 2 -2.54,0; 5 2.54,0; 6 5.08,0; 7 7.62,0
TME = drill 0.7 pad 1.1 round: 1 -3.81,0; 2 -1.27,0; 3 1.27,0; 4 3.81,0
AK500/3-H = drill 1.321 long: 1 -5.004,0; 2 0,0; 3 5.004,0
AK500/4-H = drill 1.321 long: 1 -7.518,0; 2 -2.489,0; 3 2.489,0; 4 7.518,0

### Placement (x,y rotation side)
B301  12.7,19.68 0 top
C201  33.66,142.88 90 bottom
C202  30.48,151.13 0 bottom
C203  30.48,148.59 180 top
C204  38.1,137.79 270 top
C205  40.64,137.79 270 bottom
C301  12.7,93.34 0 top
C302  12.7,117.47 0 top
C303  12.7,141.6 0 top
C304  67.31,20.32 270 top
C305  53.98,15.24 90 top
C306  59.05,20.32 270 top
C401  77.47,27.94 180 bottom
C402  65.41,26.04 270 top
C403  77.47,45.72 180 bottom
C404  66.04,43.81 270 top
C405  77.47,63.5 180 bottom
C406  66.04,61.59 270 top
C407  77.47,114.94 180 bottom
C408  70.48,107.95 270 bottom
C501  53.98,31.75 90 top
C502  53.98,49.53 90 top
C503  53.98,67.31 90 top
C504  53.98,85.72 90 top
C505  53.98,102.23 90 top
C506  53.98,118.75 90 top
C601  67.31,26.04 270 top
C602  67.94,43.81 270 top
C603  67.94,61.59 270 top
C604  67.94,80.64 270 top
C605  67.94,97.16 270 top
C606  67.94,113.67 270 top
C607  66.04,80.64 270 top
C608  66.04,97.16 270 top
C609  66.04,113.67 270 top
D101  36.2,149.22 180 bottom
D201  35.56,142.88 270 bottom
D301  43.18,11.43 180 bottom
D302  64.14,16.51 180 top
D303  56.52,15.24 90 top
D304  18.41,67.31 180 bottom
D501  56.52,31.75 90 top
D502  56.52,49.53 90 top
D503  56.52,67.31 90 top
D504  56.52,85.72 90 top
D505  56.52,102.23 90 top
D506  56.52,118.75 90 top
D601  64.14,33.02 180 top
D602  64.14,50.8 180 top
D603  64.14,68.58 180 top
D604  64.14,87 180 top
D605  64.14,103.5 180 top
D606  64.14,120.02 180 top
HIC701  66.67,38.1 0 top
HIC702  66.67,55.88 0 top
HIC703  66.67,73.66 0 top
HIC704  66.67,125.09 0 top
HIC705  66.67,137.16 0 top
IC201  30.48,142.88 0 bottom
IC301  74.93,15.24 90 top
IC601  74.93,31.75 90 top
IC602  74.93,49.53 90 top
IC603  74.93,67.31 90 top
IC604  74.93,85.72 90 top
IC605  74.93,102.23 90 top
IC606  74.93,118.75 90 top
K301  18.41,64.77 270 top
L201  38.1,146.05 270 top
Q301  43.18,15.24 90 top
Q302  26.67,125.09 180 top
Q501  43.18,31.75 90 top
Q502  43.18,49.53 90 top
Q503  43.18,67.31 90 top
Q504  43.18,85.72 90 top
Q505  43.18,102.23 90 top
Q506  43.18,118.75 90 top
R101  84.45,13.97 180 top
R102  84.45,30.48 0 top
R103  84.45,48.26 0 top
R104  84.45,66.04 0 top
R105  84.45,84.45 0 top
R106  84.45,100.97 0 top
R107  84.45,117.47 0 top
R201  26.67,137.79 270 bottom
R202  26.67,142.88 270 bottom
R301  5.08,64.77 90 top
R302  13.34,156.21 180 top
R303  18.41,156.21 180 top
R304  64.14,13.97 180 top
R305  23.5,156.21 180 top
R306  18.41,50.16 0 top
R307  46.35,131.44 270 top
R308  59.05,15.24 270 top
R309  37.47,110.49 180 bottom
R310  26.67,130.18 0 top
R311  26.67,128.27 0 top
R501  55.88,34.29 180 bottom
R502  55.88,52.07 180 bottom
R503  55.88,69.85 180 bottom
R601  64.14,30.48 180 top
R602  64.14,48.26 180 top
R603  64.14,66.04 180 top
R604  59.05,31.75 270 top
R605  59.05,49.53 270 top
R606  59.05,67.31 270 top
R607  64.14,84.45 180 top
R608  64.14,100.97 180 top
R609  64.14,117.47 180 top
R610  59.05,85.72 270 top
R611  59.05,102.23 270 top
R612  59.05,118.75 270 top
SV101  69.85,146.69 180 top
V201  92.71,22.23 90 top
V401  74.93,24.77 180 top
V402  74.93,42.55 180 top
V403  74.93,60.33 180 top
V404  74.93,111.76 180 top
X101  35.56,154.31 180 top
X102  22.23,5.71 0 top
X103  37.47,5.71 0 top
X104  52.7,5.71 0 top
X105  70.48,5.71 0 top

### Tracks (layer width: path | path; a pad name or v marks a point on that pad's centre or on a via)
24V_AUX  (via drill 0.5 pad 2.18)
  Bottom 0.813: IC201.7 31.11,147.96 C203.+ | C203.+ 31.75,150.71 C202.1 | D101.C 32.38,149.22 C203.+
  other vias: 31.75,148.59
+12V_OR_+5V  (via drill 0.5 pad 1.52, 0.5 pad 2.18, 0.6 pad 2.18)
  Top 0.813: v12.45,69.22 19.68,69.22 22.23,71.75 22.23,74.3 22.86,74.93 22.86,132.72 v26.67,136.53 32.38,136.53 v38.1,142.24
  Bottom 0.813: D304.C 14.35,67.31 v12.45,69.22 | C205.1 40.22,139.06 C204.+ v38.1,142.24 v38.1,145.1 L201.P$2 | 76.2,114.94 C407.1 | 76.2,63.5 C405.1 | 76.2,45.72 C403.1 | 76.2,27.94 C401.1
  Bottom 1.016: v92.71,17.14 79.38,17.14 76.2,20.32 V401.2
  Bottom 1.27: V401.2 76.2,27.94 V402.2 76.2,45.72 V403.2 76.2,63.5 V404.2 76.2,114.94 76.2,120.02 72.39,123.83 SV101.16 SV101.15 72.39,151.76 71.12,153.03 46.99,153.03 42.55,157.48 39.37,157.48 38.1,156.21 38.1,151.76 38.73,151.13 40.01,151.13 40.64,150.5 40.64,144.78 v38.1,142.24
  Bottom 2.184: v12.45,69.22 K301.1
  other vias: 12.45,72.26 76.2,60.33 76.2,42.55 76.2,24.77 76.2,111.76 72.39,145.41 72.39,147.96 38.1,139.06
+15V  (via drill 0.5 pad 2.18, 0.6 pad 2.18)
  Bottom 0.813: 88.27,29.84 84.45,33.66 HIC701.5
  Bottom 1.016: 88.27,29.84 v92.71,29.84
  Bottom 1.27: HIC701.5 HIC702.5 HIC703.5 HIC704.5 HIC705.5 84.45,137.79 80.01,142.24 SV101.10 SV101.9
  other vias: 84.45,38.1 84.45,55.88 84.45,73.66 84.45,125.09 84.45,137.16 80.01,147.96 80.01,145.41
+15V_G1  (via drill 0.5 pad 2.18)
  Top 0.813: V401.4 71.12,27.94 v71.75,27.94 IC601.8 | 60.96,27.3 61.09,27.43 C402.1 67.18,27.43 67.31,27.3 C601.1
  Top 1.016: v53.98,38.1 v53.98,40.01 60.33,40.01 62.23,38.1 v71.12,38.1 | IC601.8 68.36,27.94 C601.1
  Bottom 1.016: v71.12,38.1 71.75,37.47 v71.75,27.94 71.75,25.4 V401.4
  other vias: 71.12,24.77
+15V_G2  (via drill 0.5 pad 2.18)
  Top 0.813: 71.12,45.72 v71.75,45.72 | 71.12,45.72 V402.4 | IC602.8 71.12,45.72 | C602.1 67.39,45.22 C404.1 61.09,45.22 60.96,45.09
  Top 1.016: v53.98,55.88 v53.98,57.78 60.33,57.78 62.23,55.88 v71.12,55.88 | IC602.8 69,45.72 C602.1
  Bottom 1.016: v71.12,55.88 71.75,55.24 v71.75,45.72 71.75,43.18 V402.4
  other vias: 71.12,42.55
+15V_G3  (via drill 0.5 pad 2.18)
  Top 0.813: V403.4 71.12,63.5 v71.75,63.5 IC603.8 | 60.96,62.87 61.09,62.99 C406.1 67.39,62.99 C603.1
  Top 1.016: v53.98,73.66 v53.98,75.56 60.33,75.56 62.23,73.66 v71.12,73.66 | IC603.8 69,63.5 C603.1
  Bottom 1.016: v71.12,73.66 71.75,73.03 v71.75,63.5 71.75,60.96 V403.4 | v53.98,75.56 v53.98,73.66
  other vias: 71.12,60.33
+15V_G456  (via drill 0.5 pad 2.18)
  Top 0.813: IC606.8 | IC606.8 | 67.31,20.95 64.14,20.95 62.87,22.23 59.05,22.23 | 67.31,20.95 71.75,20.95 73.03,19.68 73.03,12.7 71.75,11.43 IC301.8 | 67.31,20.95 C304.1 | IC606.8 68.36,114.94 C606.1 67.39,115.06 C609.1 61.09,115.06 60.96,114.94 | IC606.8 70.16,112.72 V404.4 | v60.96,98.42 61.09,98.56 C608.1 67.39,98.56 C605.1 68.36,98.42 IC605.8 | v60.96,81.92 61.09,82.05 C607.1 67.39,82.05 C604.1 | 59.05,22.23 38.73,22.23 36.2,24.77 29.21,24.77 27.3,26.67 27.3,41.27 18.41,50.16 18.41,59.69 27.3,68.58 27.3,120.02 34.92,127.64 v53.98,127.64 v53.98,134.62 | 59.05,22.23 C306.1
  Top 1.016: IC604.8 68.36,81.92 C604.1
  Top 1.27: v60.96,109.86 v68.58,109.86 69.85,109.86 71.12,111.12 V404.4
  Bottom 0.813: 70.48,109.86 C408.1
  Bottom 1.27: v53.98,134.62 55.88,134.62 58.42,132.08 61.59,132.08 62.87,130.81 62.87,111.76 v60.96,109.86 v60.96,98.42 v60.96,81.92 | v68.58,109.86 70.48,109.86 71.12,110.49 V404.4
  Bottom 2.184: v53.98,127.64 v53.98,125.09 | v53.98,134.62 v53.98,137.16
  other vias: 71.12,111.76
-15V  (via drill 0.5 pad 2.18, 0.6 pad 2.18)
  Bottom 0.813: HIC701.6 87,33.66 88.27,32.38 93.98,32.38 95.25,31.11 95.25,26.04 93.98,24.77 V201.5
  Bottom 1.016: 88.27,24.77 V201.5
  Bottom 1.27: HIC701.6 87,38.73 86.36,39.37 86.36,54.61 87,55.24 HIC702.6 87,56.52 86.36,57.15 86.36,72.39 87,73.03 HIC703.6 87,74.3 86.36,74.93 86.36,123.83 87,124.46 HIC704.6 87,125.73 86.36,126.36 86.36,135.89 87,136.53 HIC705.6 87,137.79 82.55,142.24 SV101.8 SV101.7
  other vias: 87,38.1 87,55.88 87,73.66 87,125.09 87,137.16 82.55,145.41 82.55,147.96 92.71,24.77
AGND  (via drill 0.5 pad 2.18, 0.6 pad 2.18)
  Bottom 0.813: v81.92,38.1 81.92,33.66 88.27,27.3
  Bottom 1.016: 88.27,27.3 V201.6
  Bottom 1.27: v81.92,38.1 81.92,38.73 82.55,39.37 82.55,54.61 81.92,55.24 v81.92,55.88 81.92,56.52 82.55,57.15 82.55,72.39 81.92,73.03 v81.92,73.66 81.92,74.3 82.55,74.93 82.55,123.83 81.92,124.46 v81.92,125.09 81.92,125.73 82.55,126.36 82.55,135.89 81.92,136.53 v81.92,137.16 81.92,137.79 77.47,142.24 SV101.12 SV101.11
  other vias: 77.47,145.41 77.47,147.96 92.71,27.3
BR_R  (via drill 0.5 pad 2.18)
  Top 0.61: v69.85,150.5 92.08,150.5 95.25,147.32 95.25,132.08 97.16,130.18 97.16,120.02 95.25,118.11 95.23,36.84 88.9,30.5 88.9,15.24 87.63,13.97 R101.1
  Bottom 0.61: v69.85,150.5 SV101.17
  other vias: 69.85,147.96
BR_RESISTOR
  Top 0.813: IC301.2 R101.2
BRIDGE_U  (via drill 0.5 pad 2.18, 0.5 pad 2.54)
  Top 0.813: V401.3 73.66,33.66 71.75,35.56 IC601.5 | v73.66,22.86 68.58,22.86 67.31,24.13 C601.2 66.76,24.64 C402.2 61.09,24.64 60.96,24.77
  Top 1.016: Q501.S 52.7,35.56 53.98,34.29 | 53.98,34.29 56.52,34.29 | 56.52,34.29 59.05,34.29 | 59.05,34.29 HIC701.3 | 53.98,34.29 C501.2 | 56.52,34.29 D501.A | 59.05,34.29 R604.1 | 59.05,34.29 60.33,35.56 IC601.5
  Top 2.54: v36.2,78.74 v36.2,76.83 36.2,40.01 40.64,35.56 v45.72,35.56 v47.62,35.56 Q501.S | v45.72,85.72 50.16,85.72
  Bottom 0.813: HIC701.3 55.24,41.91 53.34,41.91 52.07,40.64 52.07,35.56 53.34,34.29
  Bottom 2.184: V401.3 v73.66,22.86
  Bottom 2.54: v45.72,85.72 41.91,85.72 36.2,80.01 v36.2,78.74 v36.2,76.83 | v45.72,85.72 50.16,85.72 | v45.72,85.72 v47.62,85.72 Q504.D | Q501.S 51.81,35.56 R501.1
  other vias: 73.66,24.77 59.05,38.1 49.53,35.56 49.53,85.72
BRIDGE_V  (via drill 0.5 pad 2.18, 0.5 pad 2.54)
  Top 0.813: V402.3 73.66,51.44 71.75,53.34 IC602.5 | v73.66,40.64 69.22,40.64 67.94,41.91 C602.2 67.39,42.41 C404.2 61.09,42.41 60.96,42.55
  Top 1.016: 56.52,52.07 59.05,52.07 | 59.05,52.07 HIC702.3 | 56.52,52.07 D502.A | 59.05,52.07 R605.1 | 59.05,52.07 60.33,53.34 IC602.5 | 53.98,52.07 56.52,52.07 | 53.98,52.07 C502.2 | Q502.S 52.7,53.34 53.98,52.07
  Top 2.54: v36.83,95.25 v36.83,92.71 36.83,83.19 40.64,79.38 40.64,57.15 44.45,53.34 v45.72,53.34 v47.62,53.34 Q502.S | v45.72,102.23 50.16,102.23
  Bottom 0.813: HIC702.3 55.24,59.69 53.34,59.69 52.07,58.42 52.07,53.34 53.34,52.07
  Bottom 2.184: V402.3 v73.66,40.64
  Bottom 2.54: v36.83,92.71 v36.83,95.25 36.83,98.42 40.64,102.23 v45.72,102.23 v47.62,102.23 | v47.62,102.23 50.16,102.23 | v47.62,102.23 Q505.D | Q502.S v45.72,53.34 51.81,53.34 R502.1
  other vias: 73.66,42.55 59.05,55.88 49.53,53.34 49.53,102.23
BRIDGE_W  (via drill 0.5 pad 2.18, 0.5 pad 2.54)
  Top 0.813: V403.3 73.66,69.22 71.75,71.12 IC603.5 | v73.66,58.42 69.22,58.42 67.94,59.69 C603.2 67.39,60.2 C406.2 61.09,60.2 60.96,60.33
  Top 1.016: 56.52,69.85 59.05,69.85 | 53.98,69.85 56.52,69.85 | Q503.S 52.7,71.12 53.98,69.85 | 59.05,69.85 60.33,71.12 IC603.5 | 59.05,69.85 HIC703.3 | 53.98,69.85 C503.2 | 56.52,69.85 D503.A | 59.05,69.85 R606.1
  Top 2.54: v47.62,71.12 45.09,73.66 45.09,80.64 41.27,84.45 41.27,114.3 v45.72,118.75 v47.62,118.75 Q506.D | v47.62,71.12 48.9,71.12 | v45.72,71.12 v47.62,71.12 | v47.62,71.12 Q503.S
  Bottom 0.813: HIC703.3 55.24,77.47 53.34,77.47 52.07,76.2 52.07,71.12 53.34,69.85
  Bottom 2.184: V403.3 v73.66,58.42
  Bottom 2.54: v45.72,71.12 Q503.S 51.81,71.12 R503.1
  other vias: 73.66,60.33 59.05,73.66 49.53,71.12 49.53,118.75
CAP_DC-  (via drill 0.5 pad 2.18, 0.5 pad 2.54, 0.5 pad 3.81)
  Top 0.813: 67.31,19.05 C304.2 | C306.2 59.05,18.41 59.37,18.1
  Top 1.016: Q301.S 52.7,19.05 53.98,17.78 | 53.98,17.78 56.52,17.78 | 56.52,17.78 59.05,17.78 | 59.05,17.78 R308.1 | 56.52,17.78 D303.A | 53.98,17.78 C305.2 | IC301.5 67.31,19.05 60.33,19.05 59.37,18.1 59.05,17.78
  Top 2.54: X103.2 37.47,19.05 | 37.47,19.05 35.56,20.95 22.23,20.95 v20.32,22.23 | 37.47,19.05 v45.72,19.05 v47.62,19.05 Q301.S
  Top 3.81: v17.78,106.68 C301.- 17.78,85.09 5.08,72.39 5.08,59.05 10.79,53.34 R306.1
  Bottom 0.813: HIC704.2 56.52,128.27 55.24,129.54 53.34,129.54 50.8,127 39.37,127 36.83,124.46 36.83,112.66 R309.1
  Bottom 3.81: C303.- C302.- v17.78,106.68 v17.78,104.14 C301.- 22.86,98.42 22.86,106.68 26.67,110.49 R309.1 | v20.32,22.23 20.32,40.64 R306.1
  other vias: 56.52,125.09 49.53,19.05 37.47,5.71 17.78,93.34 17.78,117.47 17.78,141.6 10.79,50.16
CHARGE_RELAY  (via drill 0.5 pad 2.18, 0.6 pad 2.18)
  Top 0.813: R310.1 25.72,131.76 26.67,132.72 41.27,132.72 44.45,135.89 44.45,149.22 45.72,150.5 v67.31,150.5
  Bottom 0.813: v67.31,150.5 SV101.19
  other vias: 67.31,147.96
CURRENT_A  (via drill 0.5 pad 2.18)
  Bottom 0.61: HIC701.7 95.25,43.81 95.25,147.32 91.44,151.13 87,151.13 85.09,149.22 SV101.5
  other vias: 89.53,38.1 85.09,147.96
CURRENT_B  (via drill 0.5 pad 2.18)
  Bottom 0.61: HIC702.7 93.98,60.33 93.98,146.69 90.81,149.86 88.27,149.86 87.63,149.22 SV101.3
  other vias: 89.53,55.88 87.63,147.96
CURRENT_C  (via drill 0.5 pad 2.18)
  Bottom 0.61: HIC703.7 89.53,74.3 88.9,74.93 88.9,119.38 92.71,123.19 92.71,145.41 SV101.1
  other vias: 89.53,73.66 90.17,147.96
CURRENT_MOTOR  (via drill 0.5 pad 2.18)
  Bottom 0.61: HIC704.7 91.44,127 91.44,144.15 SV101.2
  other vias: 89.53,125.09 90.17,145.41
DC+  (via drill 0.5 pad 2.18, 0.5 pad 2.54, 0.5 pad 3.81)
  Top 2.184: X104.1 47.7,2.62 46.35,1.27 33.66,1.27 32.38,2.54 32.38,5.64 X103.1
  Top 2.54: v45.72,31.75 50.16,31.75 | v45.72,49.53 50.16,49.53 | v45.72,67.31 50.16,67.31
  Bottom 0.406: X103.1 v32.38,5.71 | X104.1 v47.62,5.71
  Bottom 0.813: C303.+ 12.06,146.05 v12.06,156.21
  Bottom 2.184: Q503.D 48.9,67.31 | 40.64,16.51 40.64,11.92 D301.C
  Bottom 2.54: X103.1 32.46,8.33 40.64,16.51 | 40.64,65.41 40.64,67.31 v45.72,67.31 | v45.72,67.31 50.16,67.31 | v45.72,67.31 v47.62,67.31 Q503.D | 40.64,49.53 v45.72,49.53 | v45.72,49.53 50.16,49.53 | v45.72,49.53 v47.62,49.53 Q502.D | 40.64,31.75 v45.72,31.75 | v45.72,31.75 50.16,31.75 | v45.72,31.75 v47.62,31.75 Q501.D
  Bottom 3.81: K301.P 12.7,80.01 R301.2 5.08,90.81 C301.+ | C301.+ v7.62,105.41 C302.+ C303.+ | 40.64,16.51 40.64,31.75 40.64,49.53 40.64,65.41 40.64,69.85 38.73,71.75 34.92,71.75 27.3,79.38 21.59,79.38 C301.+
  other vias: 5.08,80.01 18.41,74.3 49.53,31.75 49.53,67.31 49.53,49.53 7.62,93.34 7.62,117.47 7.62,141.6
DC-  (via drill 0.5 pad 2.18, 0.5 pad 2.54)
  Top 0.813: V404.3 73.66,120.65 71.75,122.56 IC606.5 66.67,122.56 v66.04,123.19 | v66.04,106.68 66.67,106.05 IC605.5 71.75,106.05 73.66,104.14 73.66,98.42 71.54,96.31 C605.2 67.39,95.75 C608.2 61.09,95.75 60.96,95.89 | v66.04,90.17 66.67,89.53 IC604.5 71.75,89.53 73.66,87.63 73.66,81.92 71.54,79.8 C604.2 67.39,79.25 C607.2 61.09,79.25 60.96,79.38 | C606.2 67.39,112.27 C609.2 60.2,112.27 59.05,111.12 59.05,108.58 60.96,106.68
  Top 1.016: v59.05,127.64 61.59,127.64 v66.04,123.19 | v66.04,123.19 66.04,127.64 v59.05,134.62 | Q504.S 50.16,89.53 52.7,89.53 53.98,88.27 | 53.98,88.27 56.52,88.27 | 56.52,88.27 59.05,88.27 | 53.98,88.27 C504.2 | 59.05,88.27 R610.1 | 56.52,88.27 D504.A | 59.05,88.27 60.96,90.17 v66.04,90.17 | 56.52,104.78 59.05,104.78 | 53.98,104.78 56.52,104.78 | Q505.S 50.16,106.05 52.7,106.05 53.98,104.78 | 59.05,104.78 60.96,106.68 v66.04,106.68 | 59.05,104.78 R611.1 | 56.52,104.78 D505.A | 53.98,104.78 C505.2 | 53.98,121.28 52.7,122.56 Q506.S | 53.98,121.28 56.52,121.28 | 56.52,121.28 D506.A | 53.98,121.28 C506.2 | 59.05,121.28 56.52,121.28 | 59.05,121.28 60.96,123.19 v66.04,123.19 | 59.05,121.28 R612.1
  Top 2.54: v45.72,89.53 50.16,89.53 | 50.16,106.05 v45.72,106.05 | Q506.S v45.72,122.56
  Bottom 0.61: 70.48,106.68 C408.2
  Bottom 0.813: HIC704.3 57.15,123.19 53.34,123.19 50.8,125.73 40.01,125.73 38.1,123.83 38.1,112.66 R309.2 | v48.9,131.44 55.24,131.44 v59.05,127.64
  Bottom 1.27: v66.04,106.68 v66.04,123.19 | v66.04,90.17 v66.04,106.68 | v73.66,109.86 73.66,108.58 71.75,106.68 70.48,106.68 v66.04,106.68
  Bottom 2.184: v59.05,127.64 HIC704.3 | Q506.S v47.62,122.56 v45.72,122.56 | v59.05,134.62 HIC705.3 | v73.66,109.86 V404.3
  Bottom 2.54: 55.88,106.05 Q505.S v47.62,106.05 v45.72,106.05 | v45.72,89.53 v47.62,89.53 Q504.S 53.34,89.53 | v45.72,122.56 Q506.S 43.81,122.56 41.27,120.02
  Bottom 3.81: 53.34,89.53 55.88,91.44 55.88,106.05 55.88,107.95 53.34,110.49 46.35,110.49 | 41.27,120.02 41.27,115.57 46.35,110.49 | 46.35,110.49 R309.2
  other vias: 59.05,125.09 59.05,137.16 73.66,111.76 49.53,89.53 49.53,106.05 49.53,122.56
G1  (via drill 0.5 pad 1.27, 0.5 pad 2.54)
  Top 1.016: Q501.G 50.8,27.94 | 50.8,27.94 52.7,27.94 53.98,29.21 | 53.98,29.21 56.52,29.21 | 56.52,29.21 59.05,29.21 | 59.05,29.21 61.44,29.21 R601.2 62.71,31.89 D601.A | 59.05,29.21 R604.2 | 53.98,29.21 C501.1 | 56.52,29.21 D501.C | 50.8,27.94 v50.8,26.67 | 50.8,27.94 v50.8,29.21
  Bottom 1.016: v50.8,26.67 v50.8,29.21
  other vias: 49.53,27.94
G2  (via drill 0.5 pad 1.27, 0.5 pad 2.54)
  Top 1.016: D602.A 62.71,49.67 R602.2 61.44,46.99 59.05,46.99 | Q502.G 50.8,45.72 | 50.8,45.72 52.7,45.72 53.98,46.99 | 53.98,46.99 56.52,46.99 | 56.52,46.99 59.05,46.99 | 59.05,46.99 R605.2 | 56.52,46.99 D502.C | 53.98,46.99 C502.1 | 50.8,45.72 v50.8,46.99 | 50.8,45.72 v50.8,44.45
  Bottom 1.016: v50.8,46.99 v50.8,44.45
  other vias: 49.53,45.72
G3  (via drill 0.5 pad 1.27, 0.5 pad 2.54)
  Top 1.016: D603.A 62.71,67.45 R603.2 61.44,64.77 59.05,64.77 | Q503.G 50.8,63.5 | 50.8,63.5 52.7,63.5 53.98,64.77 | 53.98,64.77 56.52,64.77 | 56.52,64.77 59.05,64.77 | 59.05,64.77 R606.2 | 56.52,64.77 D503.C | 53.98,64.77 C503.1 | 50.8,63.5 v50.8,64.77 | 50.8,63.5 v50.8,62.23
  Bottom 1.016: v50.8,64.77 v50.8,62.23
  other vias: 49.53,63.5
G4  (via drill 0.5 pad 1.27, 0.5 pad 2.54)
  Top 0.813: R607.2 62.71,85.87 D604.A
  Top 1.016: v49.53,81.92 50.8,81.92 | 50.8,81.92 52.7,81.92 53.98,83.19 | 53.98,83.19 56.52,83.19 | 53.98,83.19 C504.1 | 56.52,83.19 D504.C | 56.52,83.19 57.47,83.19 R610.2 60.64,84.78 60.96,84.45 R607.2 | 50.8,81.92 v50.8,83.19 | 50.8,81.92 v50.8,80.64
  Bottom 1.016: v50.8,83.19 v50.8,80.64
G5  (via drill 0.5 pad 1.27, 0.5 pad 2.54)
  Top 0.813: R608.2 62.71,102.38 D605.A
  Top 1.016: Q505.G 50.8,98.42 | 50.8,98.42 52.7,98.42 53.98,99.69 | 53.98,99.69 56.52,99.69 | 56.52,99.69 57.47,99.69 R611.2 60.64,101.28 60.96,100.97 R608.2 | 56.52,99.69 D505.C | 53.98,99.69 C505.1 | 50.8,98.42 v50.8,99.69 | 50.8,98.42 v50.8,97.16
  Bottom 1.016: v50.8,99.69 v50.8,97.16
  other vias: 49.53,98.42
G6  (via drill 0.5 pad 1.27, 0.5 pad 2.54)
  Top 0.813: R609.2 62.71,118.89 D606.A
  Top 1.016: Q506.G 50.8,114.94 | 50.8,114.94 52.7,114.94 53.98,116.2 | 53.98,116.2 56.52,116.2 | 56.52,116.2 57.47,116.2 R612.2 60.64,117.8 60.96,117.47 R609.2 | 56.52,116.2 D506.C | 53.98,116.2 C506.1 | 50.8,114.94 v50.8,116.2 | 50.8,114.94 v50.8,113.67
  Bottom 1.016: v50.8,116.2 v50.8,113.67
  other vias: 49.53,114.94
GND  (via drill 0.5 pad 2.18, 0.5 pad 3.05, 0.6 pad 2.18)
  Top 0.813: Q302.E R311.1 24.77,128.27 24.13,128.91 24.13,132.08 26.04,133.99 40.01,133.99
  Top 1.016: 42.55,136.53 40.01,133.99
  Top 1.27: 77.47,33.02 77.47,26.67 78.74,25.4 V401.1 v78.74,22.86 77.47,21.59 77.47,17.14 78.11,16.51 IC301.3 | 77.47,33.02 77.47,39.37 v78.74,40.64 V402.1 78.74,43.18 76.2,45.72 76.2,50.8 | 77.47,33.02 IC601.3 | 76.2,68.58 76.2,63.5 78.74,60.96 V403.1 v78.74,58.42 76.2,55.88 76.2,50.8 | 76.2,68.58 IC603.3 | 76.2,68.58 76.2,87 | 76.2,87 76.2,103.5 | 76.2,103.5 76.2,107.31 v78.74,109.86 V404.1 78.74,112.39 76.2,114.94 76.2,120.02 | 76.2,50.8 IC602.3 | 76.2,87 IC604.3 | 76.2,103.5 IC605.3 | 76.2,120.02 v76.2,125.09 | 76.2,120.02 IC606.3 | v74.93,152.4 74.3,153.03 45.09,153.03 v44.45,152.4 42.55,150.5 42.55,136.53
  Bottom 0.813: 29.84,143.51 IC201.6 29.84,147.96 C203.- | 29.84,143.51 30.48,142.88 30.48,140.28 | 30.48,140.28 IC201.2 30.48,139.64 30.48,138.43 31.11,137.79 35.56,137.79 D201.A | 30.48,140.28 IC201.3 | 29.84,143.51 26.89,143.51 R202.1 | v40.64,154.31 X101.1 | C407.2 78.74,114.81 V404.1 | C405.2 78.74,63.37 V403.1 | C403.2 78.74,45.59 V402.1 | C401.2 78.74,27.81 V401.1
  Bottom 1.016: v92.71,19.68 81.92,19.68 v78.74,22.86
  Bottom 1.27: v76.2,125.09 74.93,126.36 SV101.14 SV101.13 v74.93,152.4 | 44.45,138.43 v44.45,152.4 41.91,152.4 40.64,153.67 v40.64,154.31
  other vias: 78.74,60.33 78.74,42.55 78.74,24.77 78.74,111.76 74.93,147.96 74.93,145.41 38.1,136.53 29.21,148.59
  pour Bottom (isolate 0.61): 24.13,133.99 24.13,151.76 45.09,151.76 45.09,137.79 41.27,133.99
HV_VBUS  (via drill 0.5 pad 2.18)
  Bottom 0.813: R307.2 46.35,132.72 52.7,139.06 55.24,139.06 56.52,137.79 HIC705.2
  other vias: 46.35,131.44 56.52,137.16
L  (via drill 0.5 pad 2.54, 0.5 pad 3.81)
  Bottom 0.406: X102.1 v17.14,5.71
  Bottom 3.81: v10.16,22.23 10.16,12.7 v17.14,5.71
MCU_G1
  Top 0.813: IC601.2 R102.1
MCU_G2
  Top 0.813: IC604.2 R105.1
MCU_G3
  Top 0.813: IC602.2 R103.1
MCU_G4
  Top 0.813: IC605.2 R106.1
MCU_G5
  Top 0.813: IC603.2 R104.1
MCU_G6
  Top 0.813: IC606.2 R107.1
MOTOR_U  (via drill 0.5 pad 2.18, 0.5 pad 2.54)
  Bottom 0.406: X105.1 v62.87,5.71
  Bottom 0.813: HIC701.2 56.52,34.92 57.15,34.29 R501.2
  Bottom 2.54: X105.1 62.97,10.69 58.68,14.98 R501.2
  other vias: 56.52,38.1
MOTOR_V  (via drill 0.5 pad 2.18, 0.5 pad 2.54)
  Bottom 0.406: X105.2 v67.94,5.71
  Bottom 0.813: HIC702.2 56.52,52.7 57.15,52.07 R502.2
  Bottom 2.54: X105.2 68,12.01 62.87,17.14 62.87,40.64 58.68,44.83 R502.2
  other vias: 56.52,55.88
MOTOR_W  (via drill 0.5 pad 2.18, 0.5 pad 2.54)
  Bottom 0.406: X105.3 v73.03,5.71
  Bottom 0.813: HIC703.2 56.52,70.48 57.15,69.85 R503.2
  Bottom 2.54: X105.3 72.97,13.39 66.67,19.68 66.67,42.55 63.5,45.72 63.5,63.5 58.68,68.32 R503.2
  other vias: 56.52,73.66
N  (via drill 0.5 pad 2.54, 0.5 pad 3.81)
  Bottom 3.81: v15.24,22.23 15.24,18.41 22.23,11.43 X102.2
  other vias: 22.23,5.71
N$1  (via drill 0.5 pad 6.45)
  other vias: 5,5
N$2  (via drill 0.5 pad 6.45)
  other vias: 95,5
N$3  (via drill 0.5 pad 6.45)
  other vias: 5,155
N$4  (via drill 0.5 pad 6.45)
  other vias: 95,155
N$5
  Top 0.813: R304.1 65.56,15.38 D302.C IC301.6
  Top 1.016: IC301.6 IC301.7
N$6
  Top 1.016: R602.1 65.56,49.67 D602.C IC602.6 IC602.7
N$7
  Top 1.016: R601.1 65.56,31.89 D601.C IC601.6 IC601.7
N$8
  Top 0.813: IC605.7 IC605.6 D605.C 65.56,102.38 R608.1
N$9  (via drill 0.5 pad 3.81)
  Bottom 3.81: K301.O 24.38,51.82 R306.2
  other vias: 26.04,50.16
N$10  (via drill 0.5 pad 2.18)
  Bottom 0.813: R303.1 R305.2
  other vias: 19.68,156.21 22.23,156.21
N$11
  Top 1.016: R603.1 65.56,67.45 D603.C IC603.6 IC603.7
N$12
  Top 0.813: IC604.7 IC604.6 D604.C 65.56,85.87 R607.1
N$13
  Top 0.813: IC606.7 IC606.6 D606.C 65.56,118.89 R609.1
N$14  (via drill 0.5 pad 2.18, 0.5 pad 3.81)
  Bottom 3.81: K301.S 5.08,52.7 R301.1 v5.08,22.23
  other vias: 5.08,49.53 12.45,60.07
N$15  (via drill 0.5 pad 1.27, 0.5 pad 2.54)
  Top 0.813: R304.2 62.71,15.38 D302.A
  Top 1.016: Q301.G 50.8,11.43 | 50.8,11.43 52.7,11.43 53.98,12.7 | 53.98,12.7 56.52,12.7 | 56.52,12.7 59.05,12.7 | 59.05,12.7 61.44,12.7 R304.2 | 59.05,12.7 R308.2 | 56.52,12.7 D303.C | 53.98,12.7 C305.1 | 50.8,11.43 v50.8,12.7 | 50.8,11.43 v50.8,10.16
  Bottom 1.016: v50.8,12.7 v50.8,10.16
  other vias: 49.53,11.43
N$16  (via drill 0.5 pad 2.18)
  Bottom 0.813: R302.1 R303.2
  other vias: 14.61,156.21 17.14,156.21
N$17  (via drill 0.5 pad 2.18)
  other vias: 24.38,60.07
N$18  (via drill 0.5 pad 5.08)
  other vias: 31.94,49.53
N$19  (via drill 0.5 pad 5.08)
  other vias: 31.94,31.75
N$20  (via drill 0.5 pad 5.08)
  other vias: 31.94,67.37
N$21  (via drill 0.5 pad 5.08)
  other vias: 31.94,85.72
N$22  (via drill 0.5 pad 5.08)
  other vias: 31.94,102.23
N$23  (via drill 0.5 pad 5.08)
  other vias: 31.94,118.75
N$24  (via drill 0.5 pad 2.18)
  Bottom 0.813: R305.1 24.77,154.94 21.59,151.76 21.59,131.44 23.5,129.54 33.66,129.54 35.56,131.44 R307.1
  other vias: 24.77,156.21 43.81,131.44
N$25  (via drill 0.5 pad 5.08)
  other vias: 31.94,15.24
N$27  (via drill 0.5 pad 2.18)
  Top 0.813: v79.38,137.16 79.38,139.7 82.55,142.88 v87.63,142.88
  Bottom 0.61: v87.63,142.88 SV101.4
  Bottom 0.813: v79.38,137.16 v79.38,125.09 79.38,123.83 80.64,122.56 80.64,76.2 79.38,74.93 v79.38,73.66 79.38,72.39 80.64,71.12 80.64,57.78 79.38,56.52 v79.38,55.88 79.38,55.24 80.64,53.98 80.64,40.01 79.38,38.73 v79.38,38.1
  other vias: 87.63,145.41
N$28  (via drill 0.5 pad 2.18)
  Bottom 0.61: IC201.4 26.73,140.28 R201.1
  Bottom 0.813: R201.1 R202.2
  other vias: 26.67,139.06
N$29  (via drill 0.5 pad 5.08)
  other vias: 12.7,36.2
N$31  (via drill 0.5 pad 2.18)
  Top 0.813: K301.2 24.77,72.26 24.77,123.19 25.57,124 Q302.C
  Bottom 0.813: D304.A 22.48,67.31 v24.38,69.22
  Bottom 2.184: v24.38,69.22 K301.2
  other vias: 24.38,72.26
N$32
  Top 0.813: Q302.B R311.2 R310.2
N$33  (via drill 0.5 pad 2.18)
  other vias: 79.38,137.16
N$34  (via drill 0.5 pad 1.52)
  other vias: 38.1,147
N$42  (via drill 0.5 pad 3.05)
  Bottom 0.813: D101.A 36.34,151.13 34.29,151.13 31.11,154.31 X101.3 v30.48,154.31
N$57  (via drill 0.5 pad 3.05)
  other vias: 35.56,154.31
N$58  (via drill 0.5 pad 2.18)
  other vias: 64.77,147.96
N$59  (via drill 0.5 pad 2.18)
  other vias: 62.23,147.96
N$60  (via drill 0.5 pad 2.18)
  other vias: 59.69,147.96
N$61  (via drill 0.5 pad 2.18)
  other vias: 57.15,147.96
N$62  (via drill 0.5 pad 2.18)
  other vias: 54.61,147.96
N$63  (via drill 0.5 pad 2.18)
  other vias: 52.07,147.96
N$64  (via drill 0.5 pad 2.18)
  other vias: 49.53,147.96
N$65  (via drill 0.5 pad 2.18)
  other vias: 49.53,145.41
N$66  (via drill 0.5 pad 2.18)
  other vias: 52.07,145.41
N$67  (via drill 0.5 pad 2.18)
  other vias: 54.61,145.41
N$72
  Bottom 0.813: C201.2 33.66,144.21 IC201.8 32.94,144.93 D201.C
  Bottom 1.27: L201.P$1 36.56,147.05 35.56,146.05 D201.C
N$80
  Bottom 0.813: C201.1 33.66,141.54 IC201.1
PE  (via drill 0.5 pad 2.54)
  Bottom 0.406: X102.3 v27.3,5.71 | X104.3 v57.78,5.71 | X105.4 v78.11,5.71 | X103.3 v42.55,5.71
  Bottom 2.184: X102.3 27.23,2.62 27.94,1.91 42.55,1.91 | X104.3 57.78,5.64 57.78,1.91 | X103.3 42.47,1.98 42.55,1.91 | 42.55,1.91 57.78,1.91 | 57.78,1.91 76.83,1.91 78.11,3.17 78,3.28 X105.4
PWM1_H  (via drill 0.5 pad 2.18)
  Top 0.61: v69.85,142.88 78.74,133.99 91.76,133.99 96.2,129.54 96.2,120.65 93.98,118.43 93.98,37.47 87,30.48 R102.2
  Bottom 0.61: v69.85,142.88 SV101.18
  other vias: 69.85,145.41
PWM1_L  (via drill 0.5 pad 2.18)
  Top 0.61: v62.23,142.88 74.93,130.18 90.81,130.18 93.34,127.64 93.34,122.56 90.17,119.38 90.17,87.63 87,84.45 R105.2
  Bottom 0.61: v62.23,142.88 SV101.24
  other vias: 62.23,145.41
PWM2_H  (via drill 0.5 pad 2.18)
  Top 0.61: v67.31,142.88 77.47,132.72 91.44,132.72 95.25,128.91 95.25,121.28 92.71,118.75 92.71,53.98 87,48.26 R103.2
  Bottom 0.61: v67.31,142.88 SV101.20
  other vias: 67.31,145.41
PWM2_L  (via drill 0.5 pad 2.18)
  Top 0.61: v59.69,142.88 73.66,128.91 90.49,128.91 92.39,127 92.39,123.19 88.9,119.7 88.9,102.87 87,100.97 R106.2
  Bottom 0.61: v59.69,142.88 SV101.26
  other vias: 59.69,145.41
PWM3_H  (via drill 0.5 pad 2.18)
  Top 0.61: v64.77,142.88 76.2,131.44 91.12,131.44 94.3,128.27 94.3,121.92 91.44,119.06 91.44,70.48 87,66.04 R104.2
  Bottom 0.61: v64.77,142.88 SV101.22
  other vias: 64.77,145.41
PWM3_L  (via drill 0.5 pad 2.18)
  Top 0.61: v57.15,142.88 72.39,127.64 90.17,127.64 91.44,126.36 91.44,123.83 87.63,120.02 87.63,118.11 87,117.47 R107.2
  Bottom 0.61: v57.15,142.88 SV101.28
  other vias: 57.15,145.41
RB-  (via drill 0.5 pad 2.54)
  Bottom 2.184: v45.72,15.24 45.72,11.92 D301.A
  Bottom 2.54: X104.2 52.7,8.26 54.61,10.16 54.61,13.97 53.34,15.24 Q301.D v47.62,15.24 v45.72,15.24
  other vias: 49.53,15.24 52.7,5.71
VBUS  (via drill 0.5 pad 2.18)
  Bottom 0.61: HIC705.7 89.53,137.79 85.09,142.24 SV101.6
  other vias: 89.53,137.16 85.09,145.41

### Text on the board
tDocu: L | N | PE | DC+ | DC- | PE | RB+ | RB- | PE | U | V | W | PE | INPUT LINE | DC BUS | Br.Resistor | MOTOR